# EAGLE design ClickMeter_BlackBox_v1_9_4 (EAGLE 7.6.0)

## Sheet 1 of 7: MICROCONTROLLER
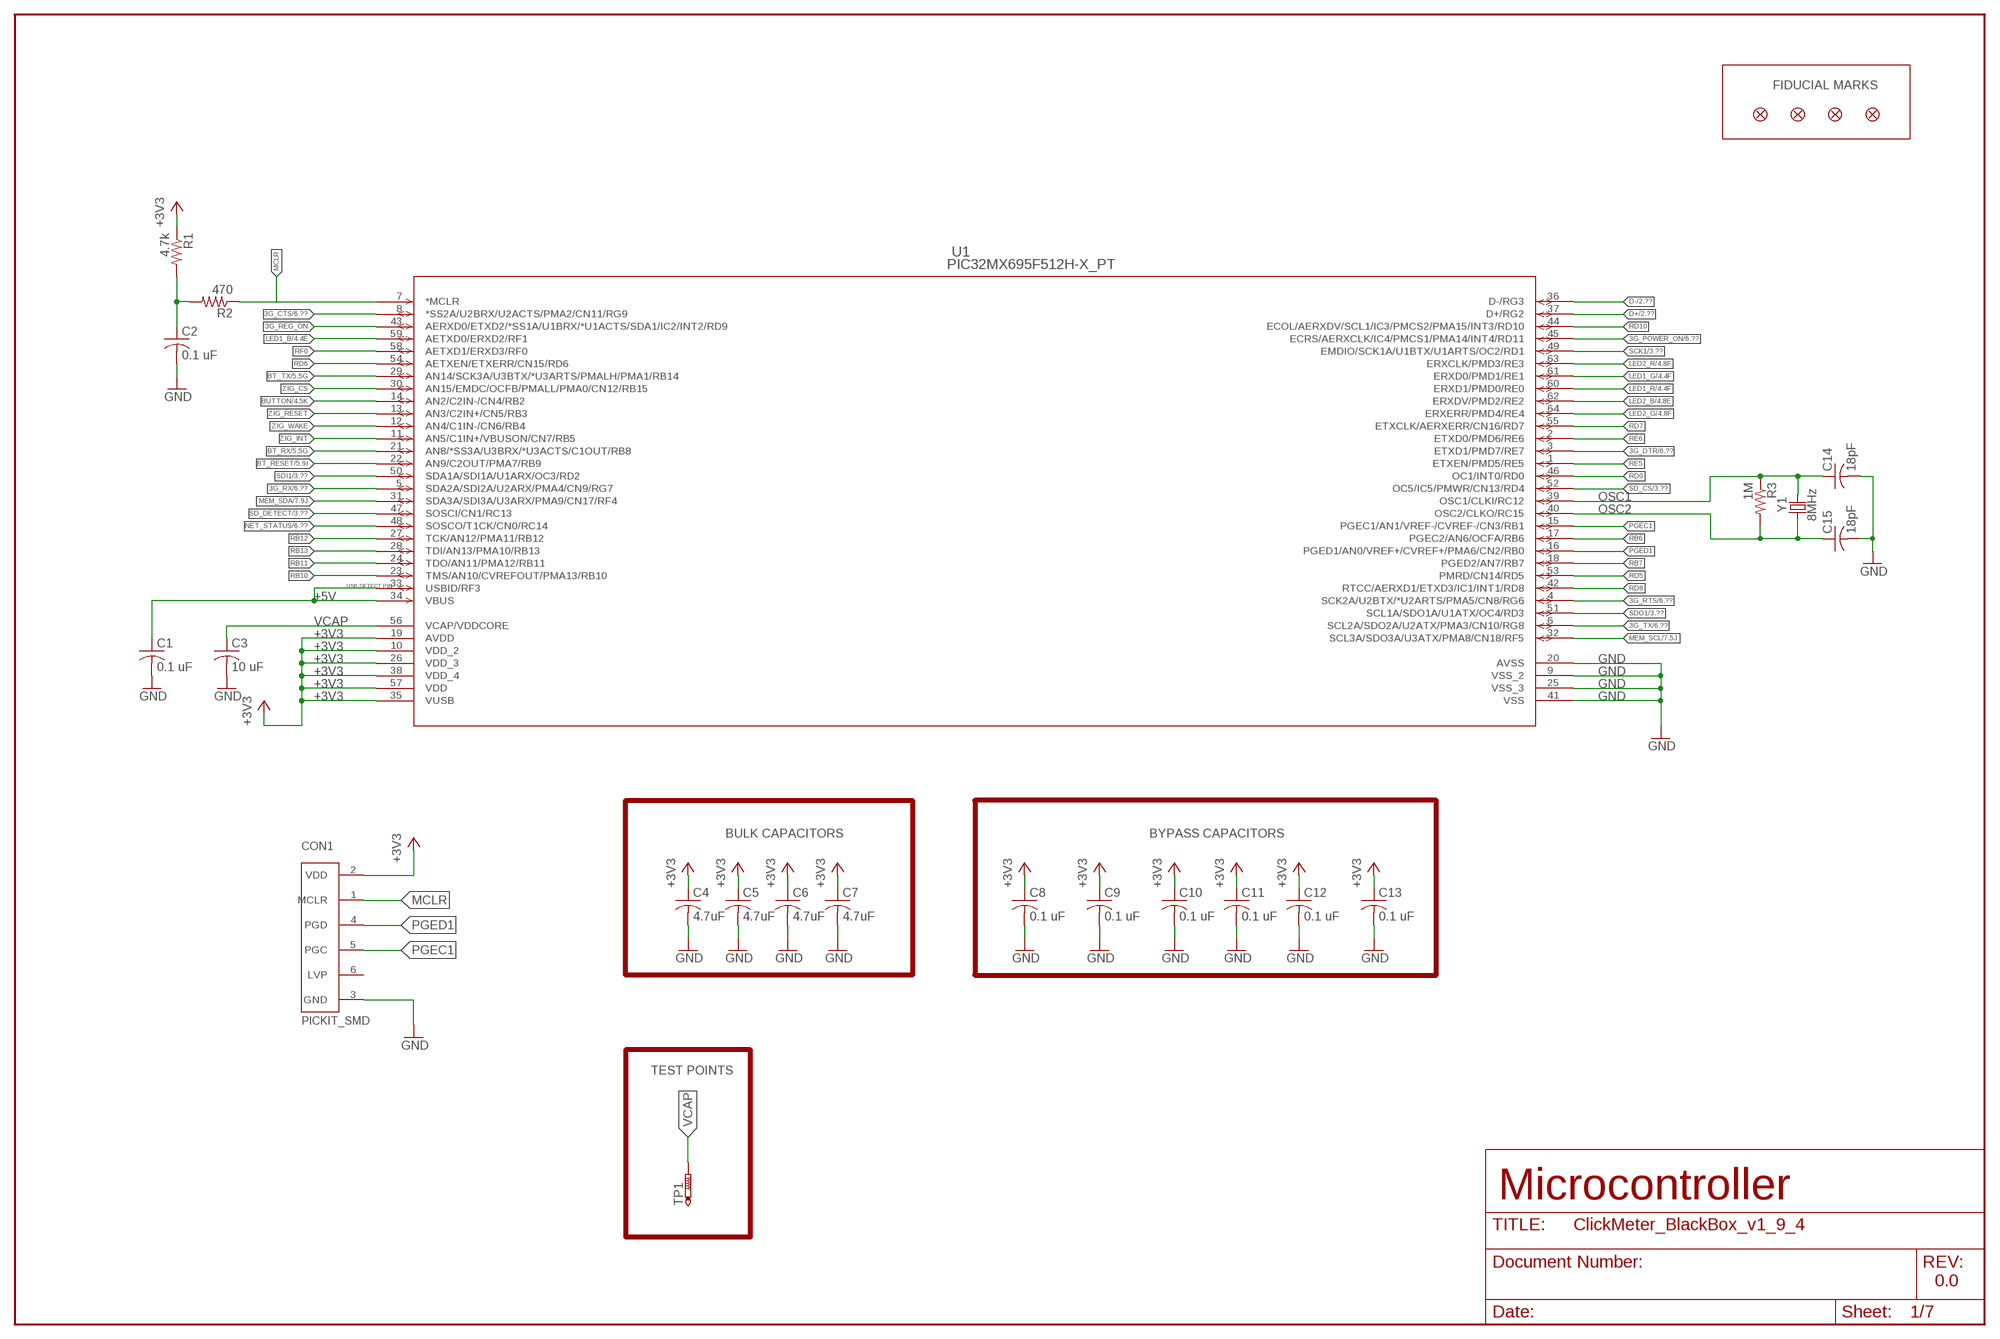
[diagram p0: schematic, sheet 1]

### Parts
C1  0.1 uF  C-USC0603  [C0603]
C2  0.1 uF  C-USC0603  [C0603]
C3  10 uF  C-USC0805  [C0805]
C4  4.7uF  C-USC0603  [C0603]
C5  4.7uF  C-USC0603  [C0603]
C6  4.7uF  C-USC0603  [C0603]
C7  4.7uF  C-USC0603  [C0603]
C8  0.1 uF  C-USC0603  [C0603]
C9  0.1 uF  C-USC0603  [C0603]
C10  0.1 uF  C-USC0603  [C0603]
C11  0.1 uF  C-USC0603  [C0603]
C12  0.1 uF  C-USC0603  [C0603]
C13  0.1 uF  C-USC0603  [C0603]
C14  18pF  C-USC0603  [C0603]
C15  18pF  C-USC0603  [C0603]
CON1  PICKIT_SMD  [SMD_PICKIT]
F1  FIDUCIAL  [FIDUCIAL]
F2  FIDUCIAL  [FIDUCIAL]
F3  FIDUCIAL  [FIDUCIAL]
F4  FIDUCIAL  [FIDUCIAL]
R1  4.7k  R-US_R0603  [R0603]
R2  470  R-US_R0603  [R0603]
R3  1M  R-US_R0603  [R0603]
TP1  PTR1B1,27  [B1,27]
U1  PIC32MX695F512H-X_PT  [TQFP64_10X10MC]
Y1  8MHz  CRYSTALTXC-7A  [CRYSTAL-TXC-7A]

### Nets
3G_CTS: U1.8(*SS2A/U2BRX/U2ACTS/PMA2/CN11/RG9) ; also sheet 6
3G_DTR: U1.3(ETXD1/PMD7/RE7) ; also sheet 6
3G_POWER_ON: U1.45(ECRS/AERXCLK/IC4/PMCS1/PMA14/INT4/RD11) ; also sheet 6
3G_REG_ON: U1.43(AERXD0/ETXD2/*SS1A/U1BRX/*U1ACTS/SDA1/IC2/INT2/RD9)
3G_RTS: U1.4(SCK2A/U2BTX/*U2ARTS/PMA5/CN8/RG6) ; also sheet 6
3G_RX: U1.5(SDA2A/SDI2A/U2ARX/PMA4/CN9/RG7) ; also sheet 6
3G_TX: U1.6(SCL2A/SDO2A/U2ATX/PMA3/CN10/RG8) ; also sheet 6
+3V3: C4.1 C5.1 C6.1 C7.1 C8.1 C9.1 C10.1 C11.1 C12.1 C13.1 CON1.2(VDD) R1.1 U1.10(VDD_2) U1.19(AVDD) U1.26(VDD_3) U1.35(VUSB) U1.38(VDD_4) U1.57(VDD) ; also sheet 2,3,4,5,7
+5V: C1.1 U1.33(USBID/RF3) U1.34(VBUS) ; also sheet 2
BT_RESET: U1.22(AN9/C2OUT/PMA7/RB9) ; also sheet 5
BT_RX: U1.21(AN8/*SS3A/U3BRX/*U3ACTS/C1OUT/RB8) ; also sheet 5
BT_TX: U1.29(AN14/SCK3A/U3BTX/*U3ARTS/PMALH/PMA1/RB14) ; also sheet 5
BUTTON: U1.14(AN2/C2IN-/CN4/RB2) ; also sheet 4
D+: U1.37(D+/RG2) ; also sheet 2
D-: U1.36(D-/RG3) ; also sheet 2
GND: C1.2 C2.2 C3.2 C4.2 C5.2 C6.2 C7.2 C8.2 C9.2 C10.2 C11.2 C12.2 C13.2 C14.2 C15.2 CON1.3(GND) U1.9(VSS_2) U1.20(AVSS) U1.25(VSS_3) U1.41(VSS) ; also sheet 2,3,4,5,6,7
LED1_B: U1.59(AETXD0/ERXD2/RF1) ; also sheet 4
LED1_G: U1.61(ERXD0/PMD1/RE1) ; also sheet 4
LED1_R: U1.60(ERXD1/PMD0/RE0) ; also sheet 4
LED2_B: U1.62(ERXDV/PMD2/RE2) ; also sheet 4
LED2_G: U1.64(ERXERR/PMD4/RE4) ; also sheet 4
LED2_R: U1.63(ERXCLK/PMD3/RE3) ; also sheet 4
MCLR: CON1.1(MCLR) R2.1 U1.7(*MCLR)
MEM_SCL: U1.32(SCL3A/SDO3A/U3ATX/PMA8/CN18/RF5) ; also sheet 7
MEM_SDA: U1.31(SDA3A/SDI3A/U3ARX/PMA9/CN17/RF4) ; also sheet 7
N$3: C2.1 R1.2 R2.2
NET_STATUS: U1.48(SOSCO/T1CK/CN0/RC14) ; also sheet 6
OSC1: C14.1 R3.1 U1.39(OSC1/CLKI/RC12) Y1.P$2
OSC2: C15.1 R3.2 U1.40(OSC2/CLKO/RC15) Y1.P$1
PGEC1: CON1.5(PGC) U1.15(PGEC1/AN1/VREF-/CVREF-/CN3/RB1)
PGED1: CON1.4(PGD) U1.16(PGED1/AN0/VREF+/CVREF+/PMA6/CN2/RB0)
RB6: U1.17(PGEC2/AN6/OCFA/RB6)
RB7: U1.18(PGED2/AN7/RB7)
RB10: U1.23(TMS/AN10/CVREFOUT/PMA13/RB10)
RB11: U1.24(TDO/AN11/PMA12/RB11)
RB12: U1.27(TCK/AN12/PMA11/RB12)
RB13: U1.28(TDI/AN13/PMA10/RB13)
RD0: U1.46(OC1/INT0/RD0)
RD5: U1.53(PMRD/CN14/RD5)
RD6: U1.54(AETXEN/ETXERR/CN15/RD6)
RD7: U1.55(ETXCLK/AERXERR/CN16/RD7)
RD8: U1.42(RTCC/AERXD1/ETXD3/IC1/INT1/RD8)
RD10: U1.44(ECOL/AERXDV/SCL1/IC3/PMCS2/PMA15/INT3/RD10)
RE5: U1.1(ETXEN/PMD5/RE5)
RE6: U1.2(ETXD0/PMD6/RE6)
RF0: U1.58(AETXD1/ERXD3/RF0)
SCK1: U1.49(EMDIO/SCK1A/U1BTX/U1ARTS/OC2/RD1) ; also sheet 3
SD_CS: U1.52(OC5/IC5/PMWR/CN13/RD4) ; also sheet 3
SD_DETECT: U1.47(SOSCI/CN1/RC13) ; also sheet 3
SDI1: U1.50(SDA1A/SDI1A/U1ARX/OC3/RD2) ; also sheet 3
SDO1: U1.51(SCL1A/SDO1A/U1ATX/OC4/RD3) ; also sheet 3
VCAP: C3.1 TP1.TP U1.56(VCAP/VDDCORE)
ZIG_CS: U1.30(AN15/EMDC/OCFB/PMALL/PMA0/CN12/RB15)
ZIG_INT: U1.11(AN5/C1IN+/VBUSON/CN7/RB5)
ZIG_RESET: U1.13(AN3/C2IN+/CN5/RB3)
ZIG_WAKE: U1.12(AN4/C1IN-/CN6/RB4)
Unconnected: CON1.6(LVP)

### Notes on the sheet
- FIDUCIAL MARKS
- USB DETECT PIN
- BULK CAPACITORS | BYPASS CAPACITORS
- TEST POINTS
- Microcontroller
- 0.0

## Sheet 2 of 7: POWER SUPPLY
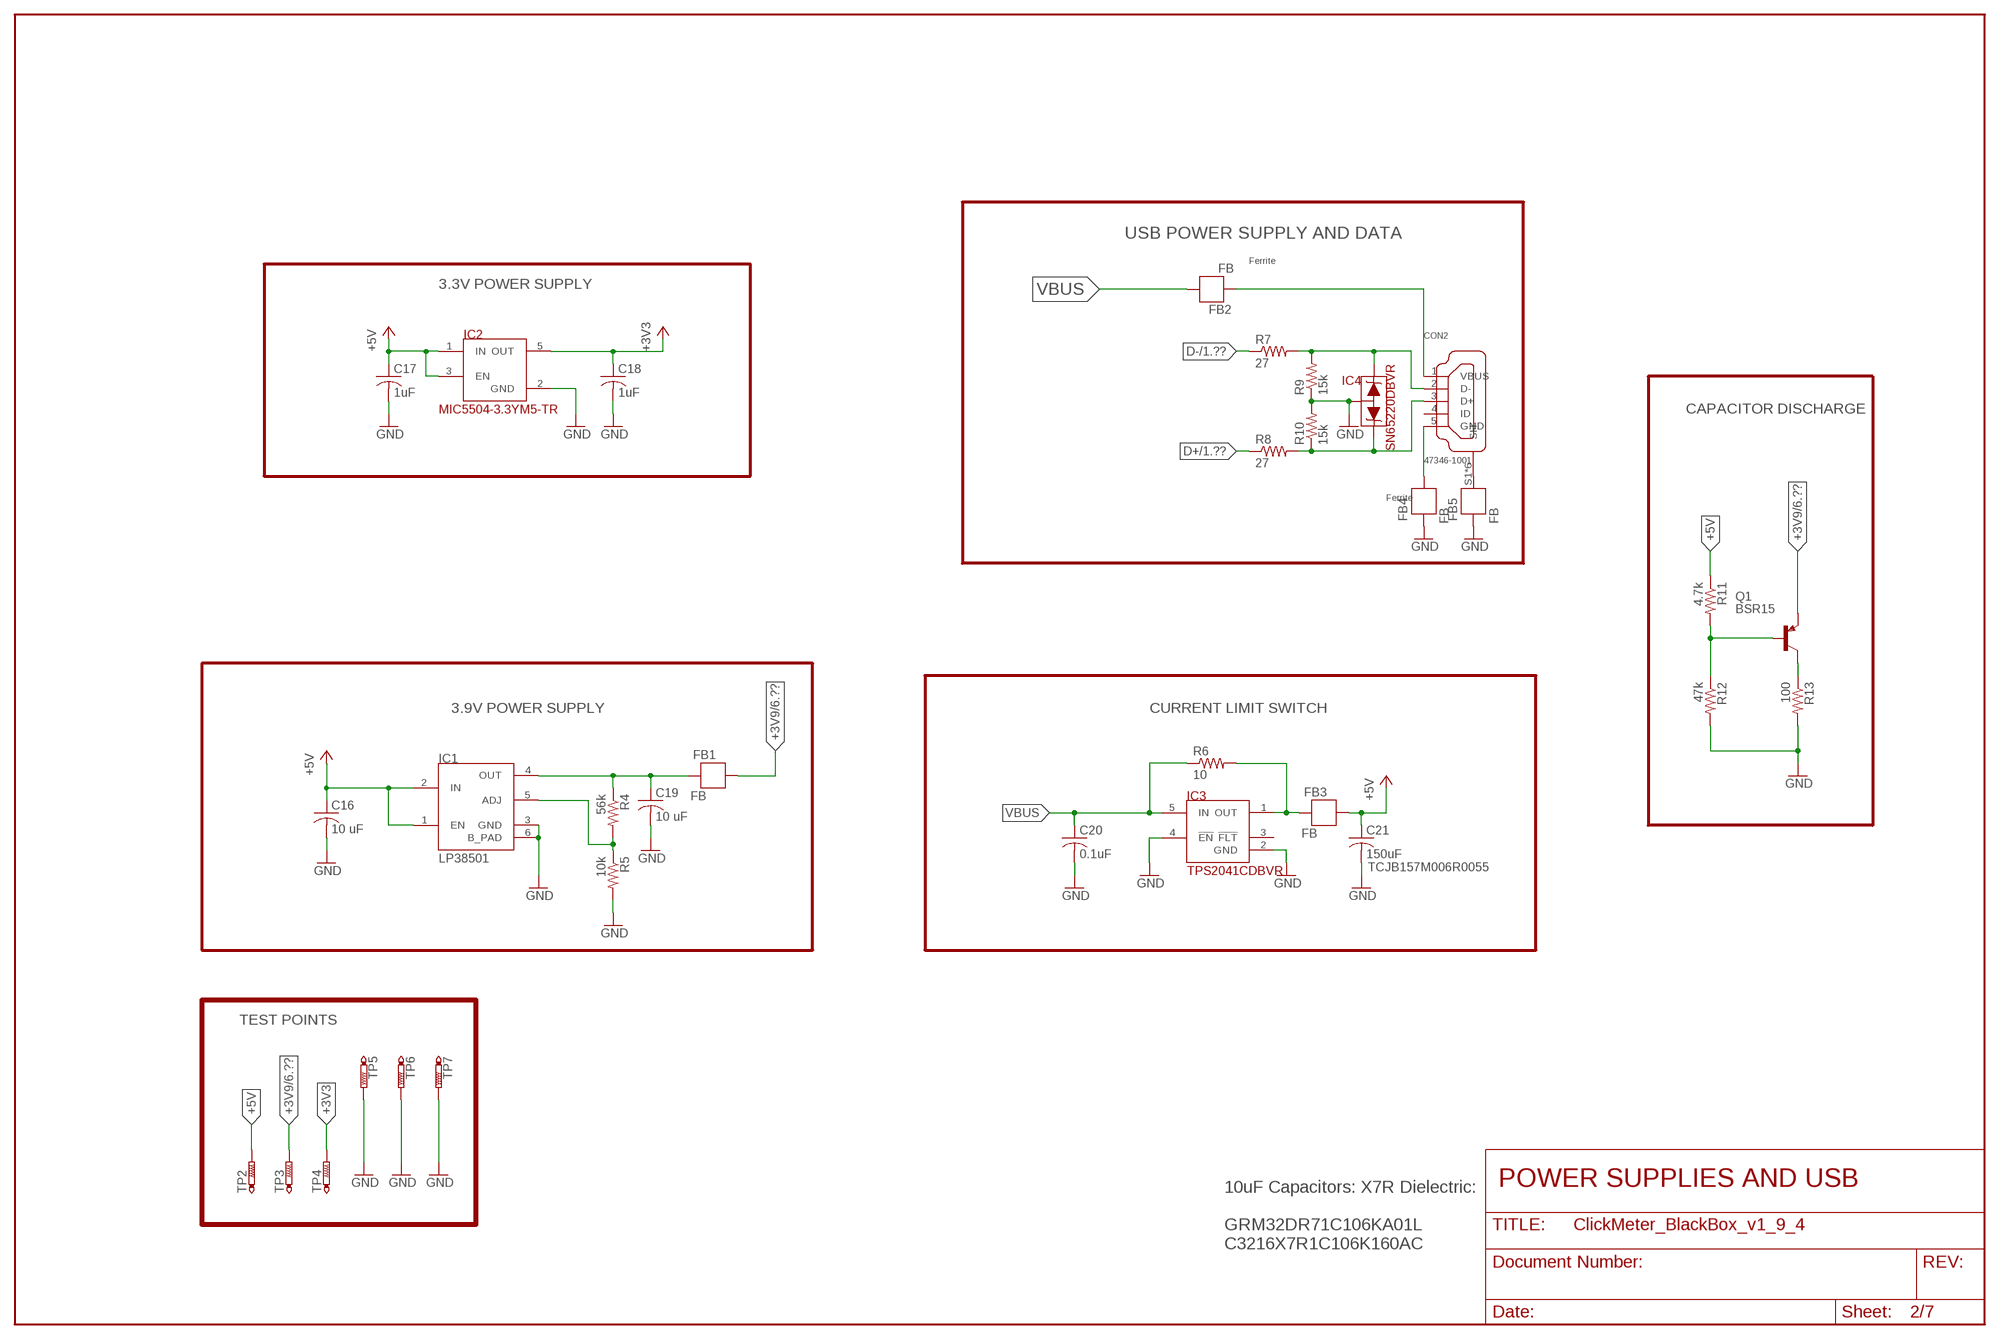
[diagram p1: schematic, sheet 2]

### Parts
C16  10 uF  C-USC0805  [C0805]
C17  1uF  C-USC0603  [C0603]
C18  1uF  C-USC0603  [C0603]
C19  10 uF  C-USC0805  [C0805]
C20  0.1uF  C-USC0603  [C0603]
C21  150uF  C-USC1210  [C1210]
CON2  47346-1001  [47346-1001]
FB1  FB  [0603]
FB2  FB  [0603]
FB3  FB  [0603]
FB4  FB  [0603]
FB5  FB  [0603]
IC1  LP38501  [TO-263-5]
IC2  MIC5504-3.3YM5-TR  [SOT-23-5]
IC3  TPS2041CDBVR  [SOT-23-5]
IC4  SN65220DBVR  [SOT-23-6]
Q1  BSR15  [SOT23]
R4  56k  R-US_R0603  [R0603]
R5  10k  R-US_R0603  [R0603]
R6  10  R-US_R2010  [R2010]
R7  27  R-US_R0603  [R0603]
R8  27  R-US_R0603  [R0603]
R9  15k  R-US_R0603  [R0603]
R10  15k  R-US_R0603  [R0603]
R11  4.7k  R-US_R0603  [R0603]
R12  47k  R-US_R0603  [R0603]
R13  100  R-US_R0603  [R0603]
TP2  PTR1B1,27  [B1,27]
TP3  PTR1B1,27  [B1,27]
TP4  PTR1B1,27  [B1,27]
TP5  PTR1B1,27  [B1,27]
TP6  PTR1B1,27  [B1,27]
TP7  PTR1B1,27  [B1,27]

### Nets
+3V3: C18.1 IC2.5(OUT) TP4.TP ; also sheet 1,3,4,5,7
+3V9: FB1.1 Q1.2(E) TP3.TP ; also sheet 6
+5V: C16.1 C17.1 C21.1 FB3.1 IC1.1(EN) IC1.2(IN) IC2.1(IN) IC2.3(EN) R11.1 TP2.TP ; also sheet 1
D+: R8.1 ; also sheet 1
D-: R7.1 ; also sheet 1
GND: C16.2 C17.2 C18.2 C19.2 C20.2 C21.2 FB4.2 FB5.2 IC1.3(GND) IC1.6(B_PAD) IC2.2(GND) IC3.2(GND) IC3.4(!EN!) IC4.2(GND) IC4.5(GND) R5.2 R9.1 R10.2 R12.2 R13.2 TP5.TP TP6.TP TP7.TP ; also sheet 1,3,4,5,6,7
N$1: C19.1 FB1.2 IC1.4(OUT) R4.1
N$5: IC1.5(ADJ) R4.2 R5.1
N$6: CON2.1(VBUS) FB2.2
N$7: FB3.2 IC3.1(OUT) R6.2
N$18: Q1.1(B) R11.2 R12.1
N$19: Q1.3(C) R13.1
N$30: CON2.S1(SH) CON2.S2(SH) CON2.S3(SH) CON2.S4(SH) CON2.S5(SH) CON2.S6(SH) FB5.1
N$31: CON2.5(GND) FB4.1
N$32: CON2.2(D-) IC4.4(B) R7.2 R9.2
N$33: CON2.3(D+) IC4.6(A) R8.2 R10.1
VBUS: C20.1 FB2.1 IC3.5(IN) R6.1
Unconnected: CON2.4(ID) IC3.3(!FLT!)

### Notes on the sheet
- USB POWER SUPPLY AND DATA
- Ferrite
- 3.3V POWER SUPPLY
- CAPACITOR DISCHARGE
- Ferrite
- 3.9V POWER SUPPLY | CURRENT LIMIT SWITCH
- TCJB157M006R0055
- TEST POINTS
- POWER SUPPLIES AND USB
- 10uF Capacitors: X7R Dielectric:
  
  GRM32DR71C106KA01L
  C3216X7R1C106K160AC

## Sheet 3 of 7: MICRO SIM/MICRO SD
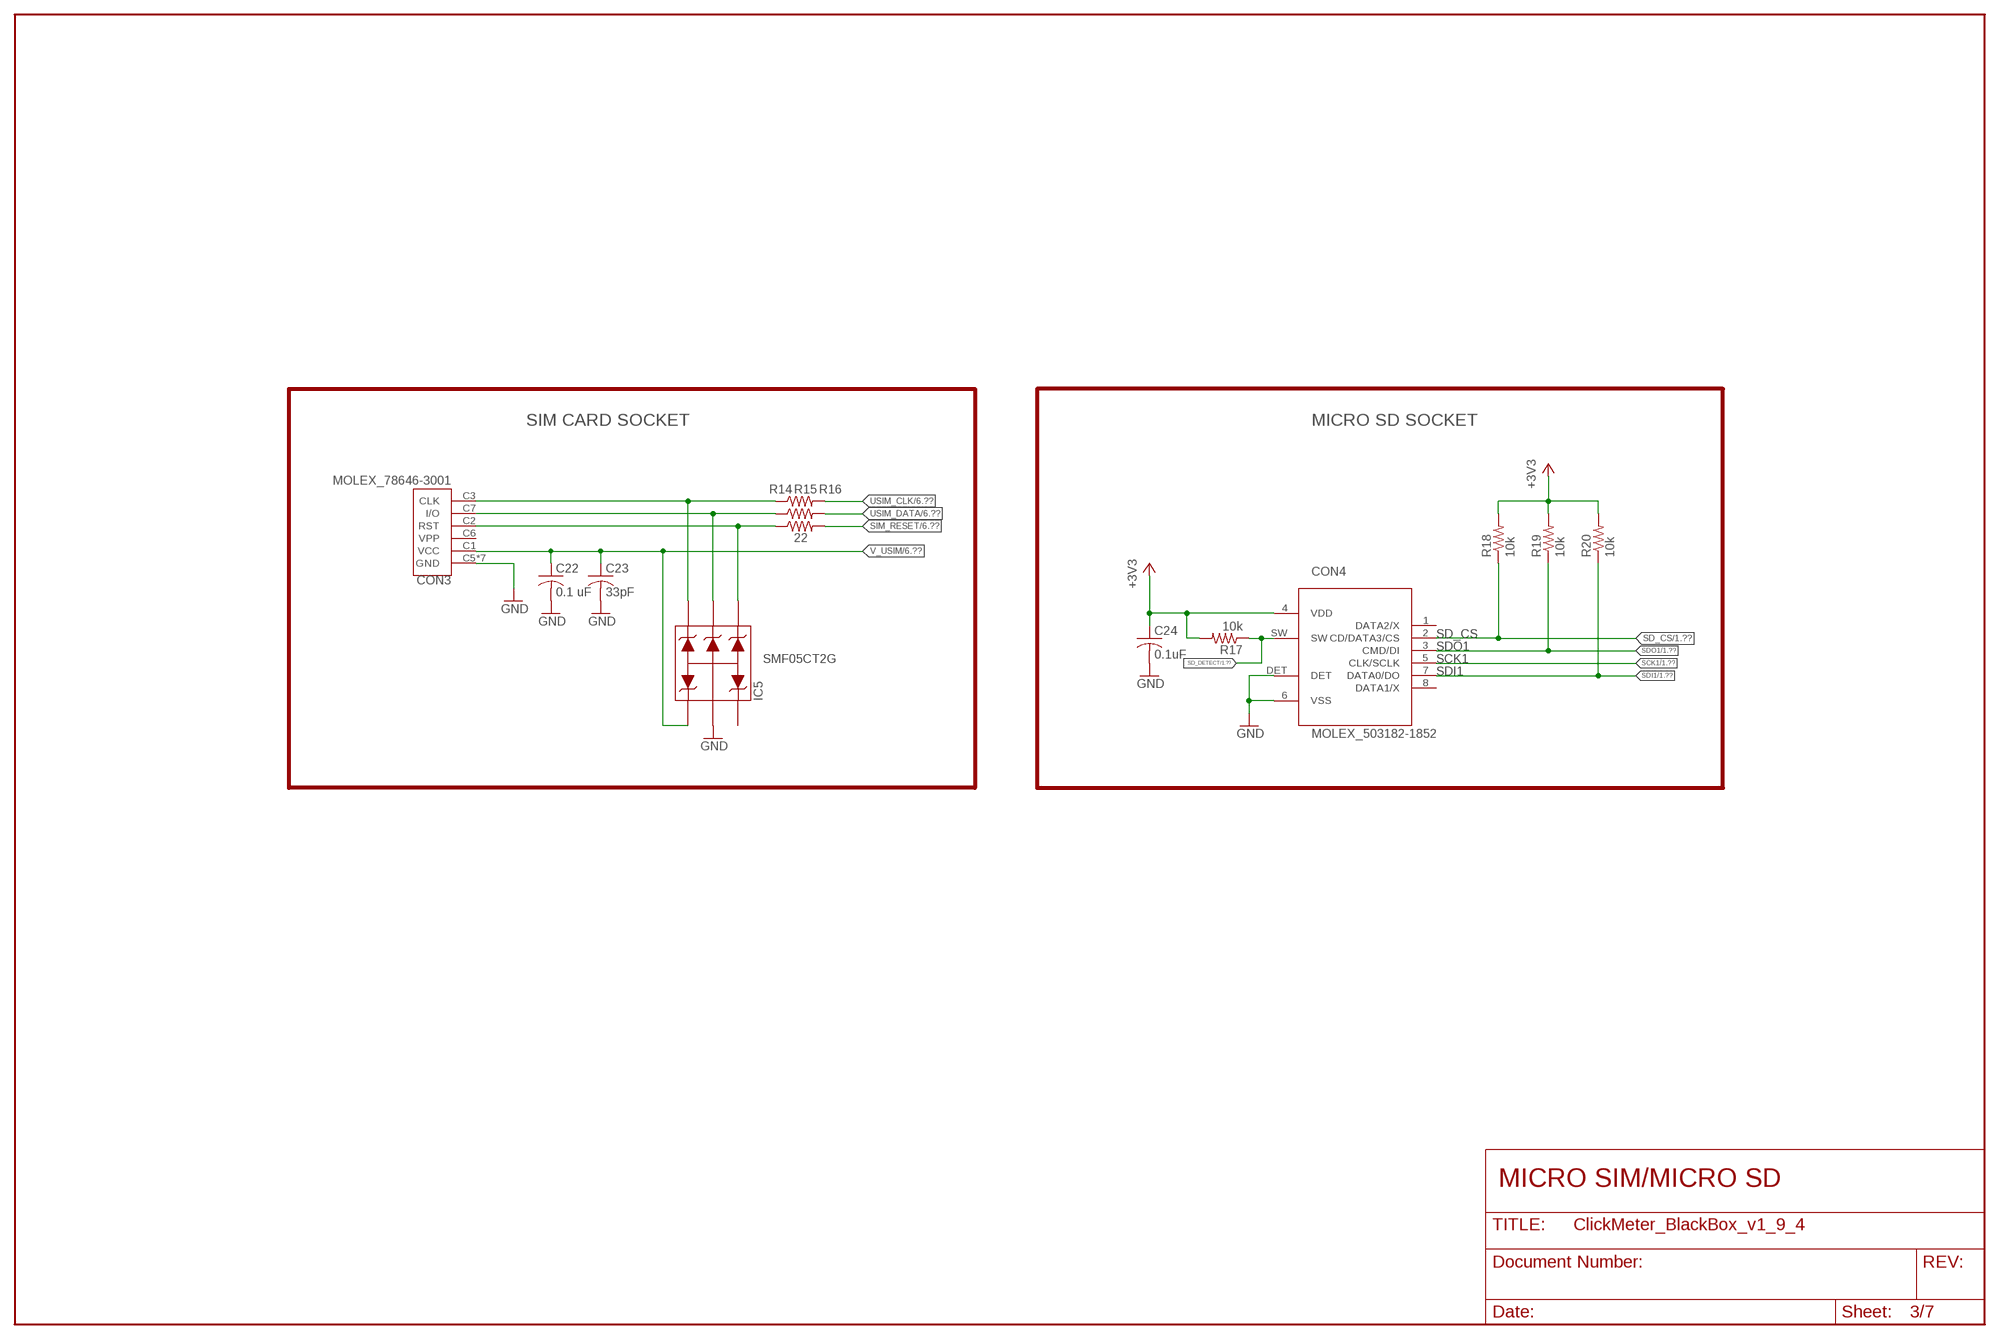
[diagram p2: schematic, sheet 3]

### Parts
C22  0.1 uF  C-USC0603  [C0603]
C23  33pF  C-USC0603  [C0603]
C24  0.1uF  C-USC0603  [C0603]
CON3  MOLEX_78646-3001  [MOLEX_78646-3001]
CON4  MOLEX_503182-1852  [MOLEX_503182-1852]
IC5  SMF05CT2G  [SC-88/SC70-6/SOT-363]
R14  22  R-US_R0603  [R0603]
R15  22  R-US_R0603  [R0603]
R16  22  R-US_R0603  [R0603]
R17  10k  R-US_R0603  [R0603]
R18  10k  R-US_R0603  [R0603]
R19  10k  R-US_R0603  [R0603]
R20  10k  R-US_R0603  [R0603]

### Nets
+3V3: C24.1 CON4.4(VDD) R17.2 R18.2 R19.2 R20.2 ; also sheet 1,2,4,5,7
GND: C22.2 C23.2 C24.2 CON3.C5(GND) CON3.GND1(GND) CON3.GND2(GND) CON3.GND3(GND) CON3.GND4(GND) CON3.GND5(GND) CON3.GND6(GND) CON4.6(VSS) CON4.DET IC5.2(AN) ; also sheet 1,2,4,5,6,7
N$9: CON3.C3(CLK) IC5.6(C5) R14.1
N$24: CON3.C7(I/O) IC5.5(C4) R15.1
N$25: CON3.C2(RST) IC5.4(C3) R16.1
SCK1: CON4.5(CLK/SCLK) ; also sheet 1
SD_CS: CON4.2(CD/DATA3/CS) R18.1 ; also sheet 1
SD_DETECT: CON4.SW R17.1 ; also sheet 1
SDI1: CON4.7(DATA0/DO) R20.1 ; also sheet 1
SDO1: CON4.3(CMD/DI) R19.1 ; also sheet 1
SIM_RESET: R16.2 ; also sheet 6
USIM_CLK: R14.2 ; also sheet 6
USIM_DATA: R15.2 ; also sheet 6
V_USIM: C22.1 C23.1 CON3.C1(VCC) IC5.1(C1) ; also sheet 6
Unconnected: CON3.C6(VPP) CON4.1(DATA2/X) CON4.8(DATA1/X) IC5.3(C2)

### Notes on the sheet
- SIM CARD SOCKET | MICRO SD SOCKET
- MICRO SIM/MICRO SD

## Sheet 4 of 7: FEEDBACK
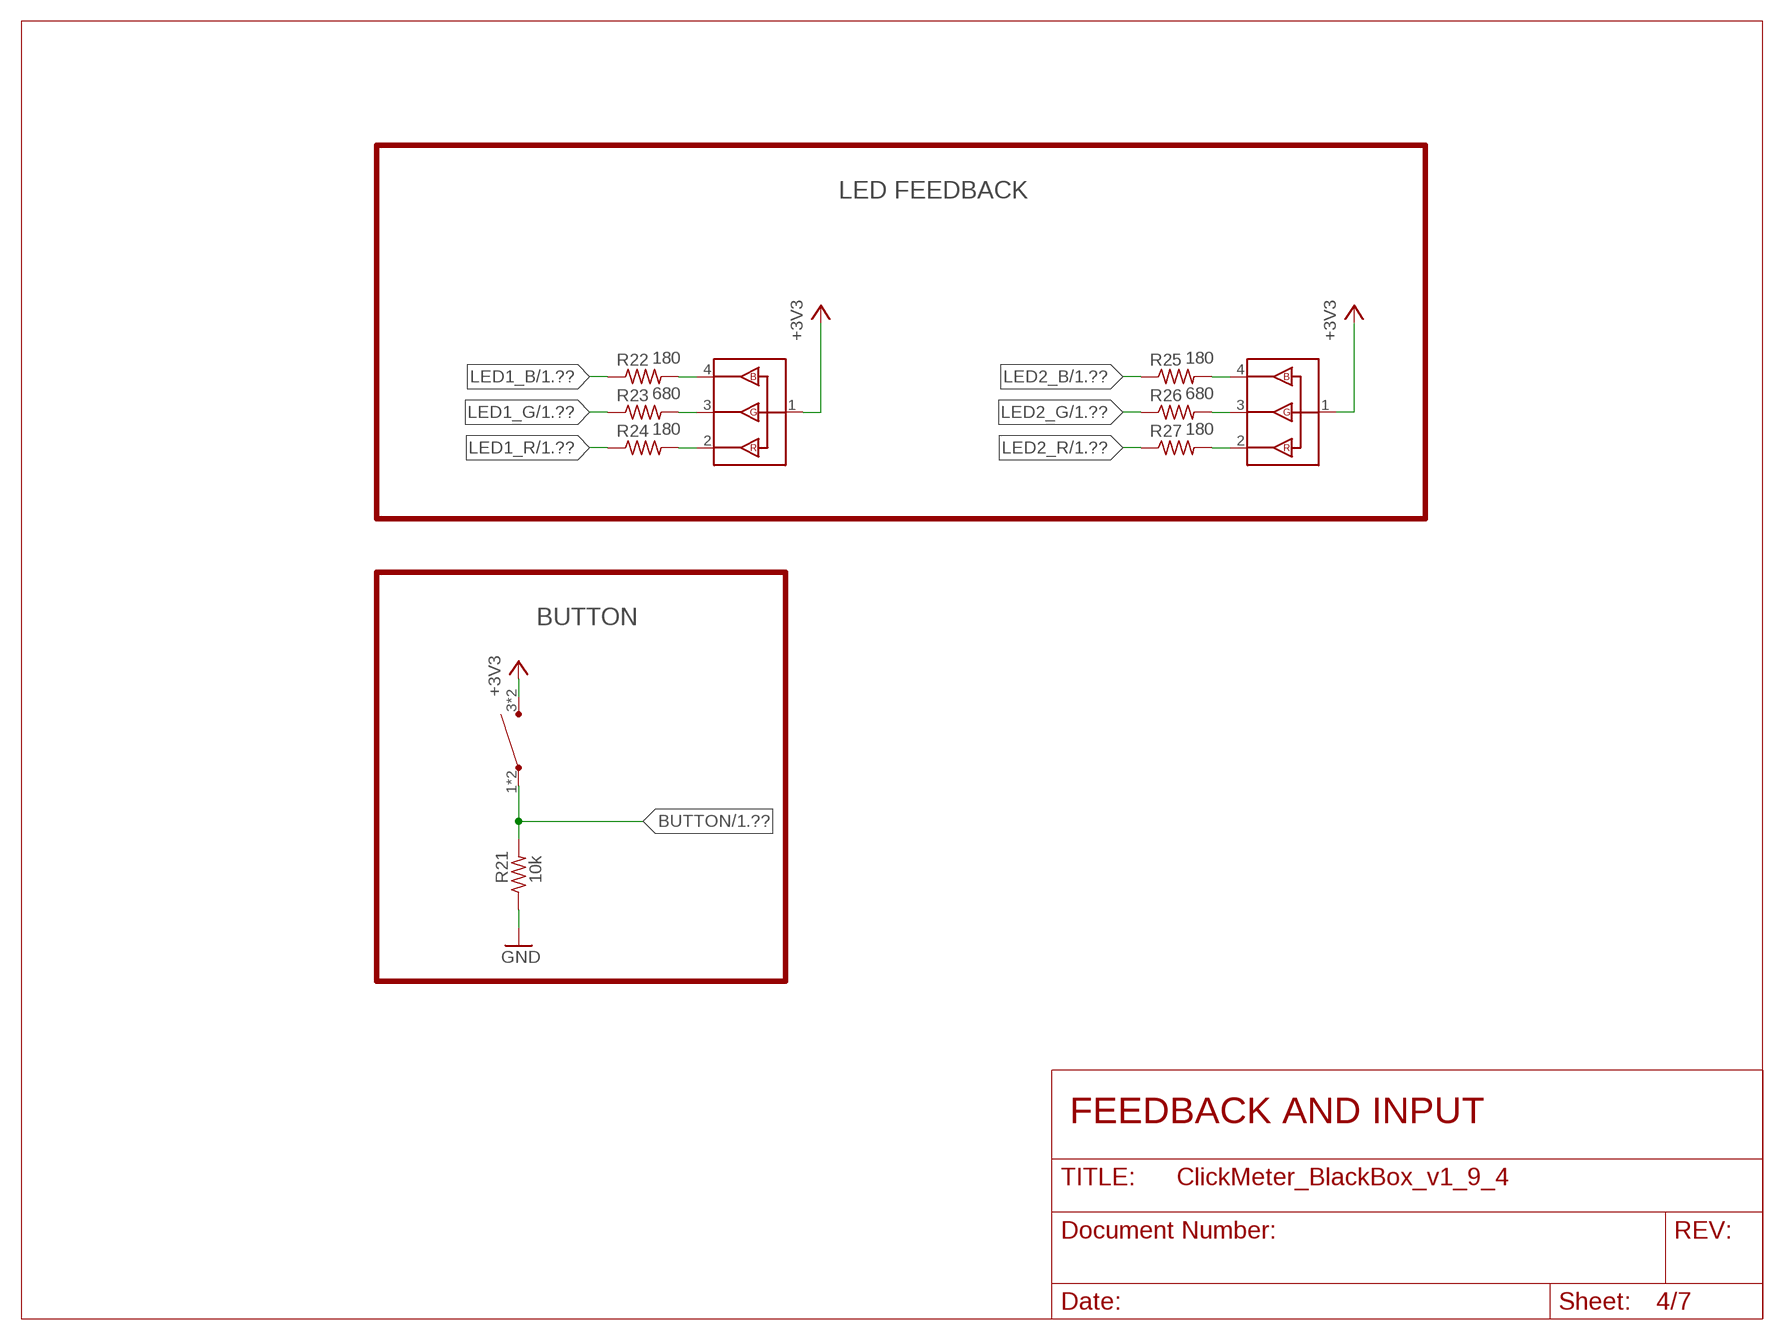
[diagram p3: schematic, sheet 4]

### Parts
BT1  PTS525_SM15  [PTS525SM15SMTR2]
LED1  APTF1616SEEZGQBDC  [APTF1616SEEZGQBDC]
LED2  APTF1616SEEZGQBDC  [APTF1616SEEZGQBDC]
R21  10k  R-US_R0603  [R0603]
R22  180  R-US_R0603  [R0603]
R23  680  R-US_R0603  [R0603]
R24  180  R-US_R0603  [R0603]
R25  180  R-US_R0603  [R0603]
R26  680  R-US_R0603  [R0603]
R27  180  R-US_R0603  [R0603]

### Nets
+3V3: BT1.3 BT1.4 LED1.1 LED2.1 ; also sheet 1,2,3,5,7
BUTTON: BT1.1 BT1.2 R21.2 ; also sheet 1
GND: R21.1 ; also sheet 1,2,3,5,6,7
LED1_B: R22.1 ; also sheet 1
LED1_G: R23.1 ; also sheet 1
LED1_R: R24.1 ; also sheet 1
LED2_B: R25.1 ; also sheet 1
LED2_G: R26.1 ; also sheet 1
LED2_R: R27.1 ; also sheet 1
N$8: LED1.3 R23.2
N$10: LED1.2 R24.2
N$11: LED1.4 R22.2
N$12: LED2.3 R26.2
N$13: LED2.2 R27.2
N$14: LED2.4 R25.2

### Notes on the sheet
- LED FEEDBACK
- BUTTON
- FEEDBACK AND INPUT

## Sheet 5 of 7: BLUETOOTH
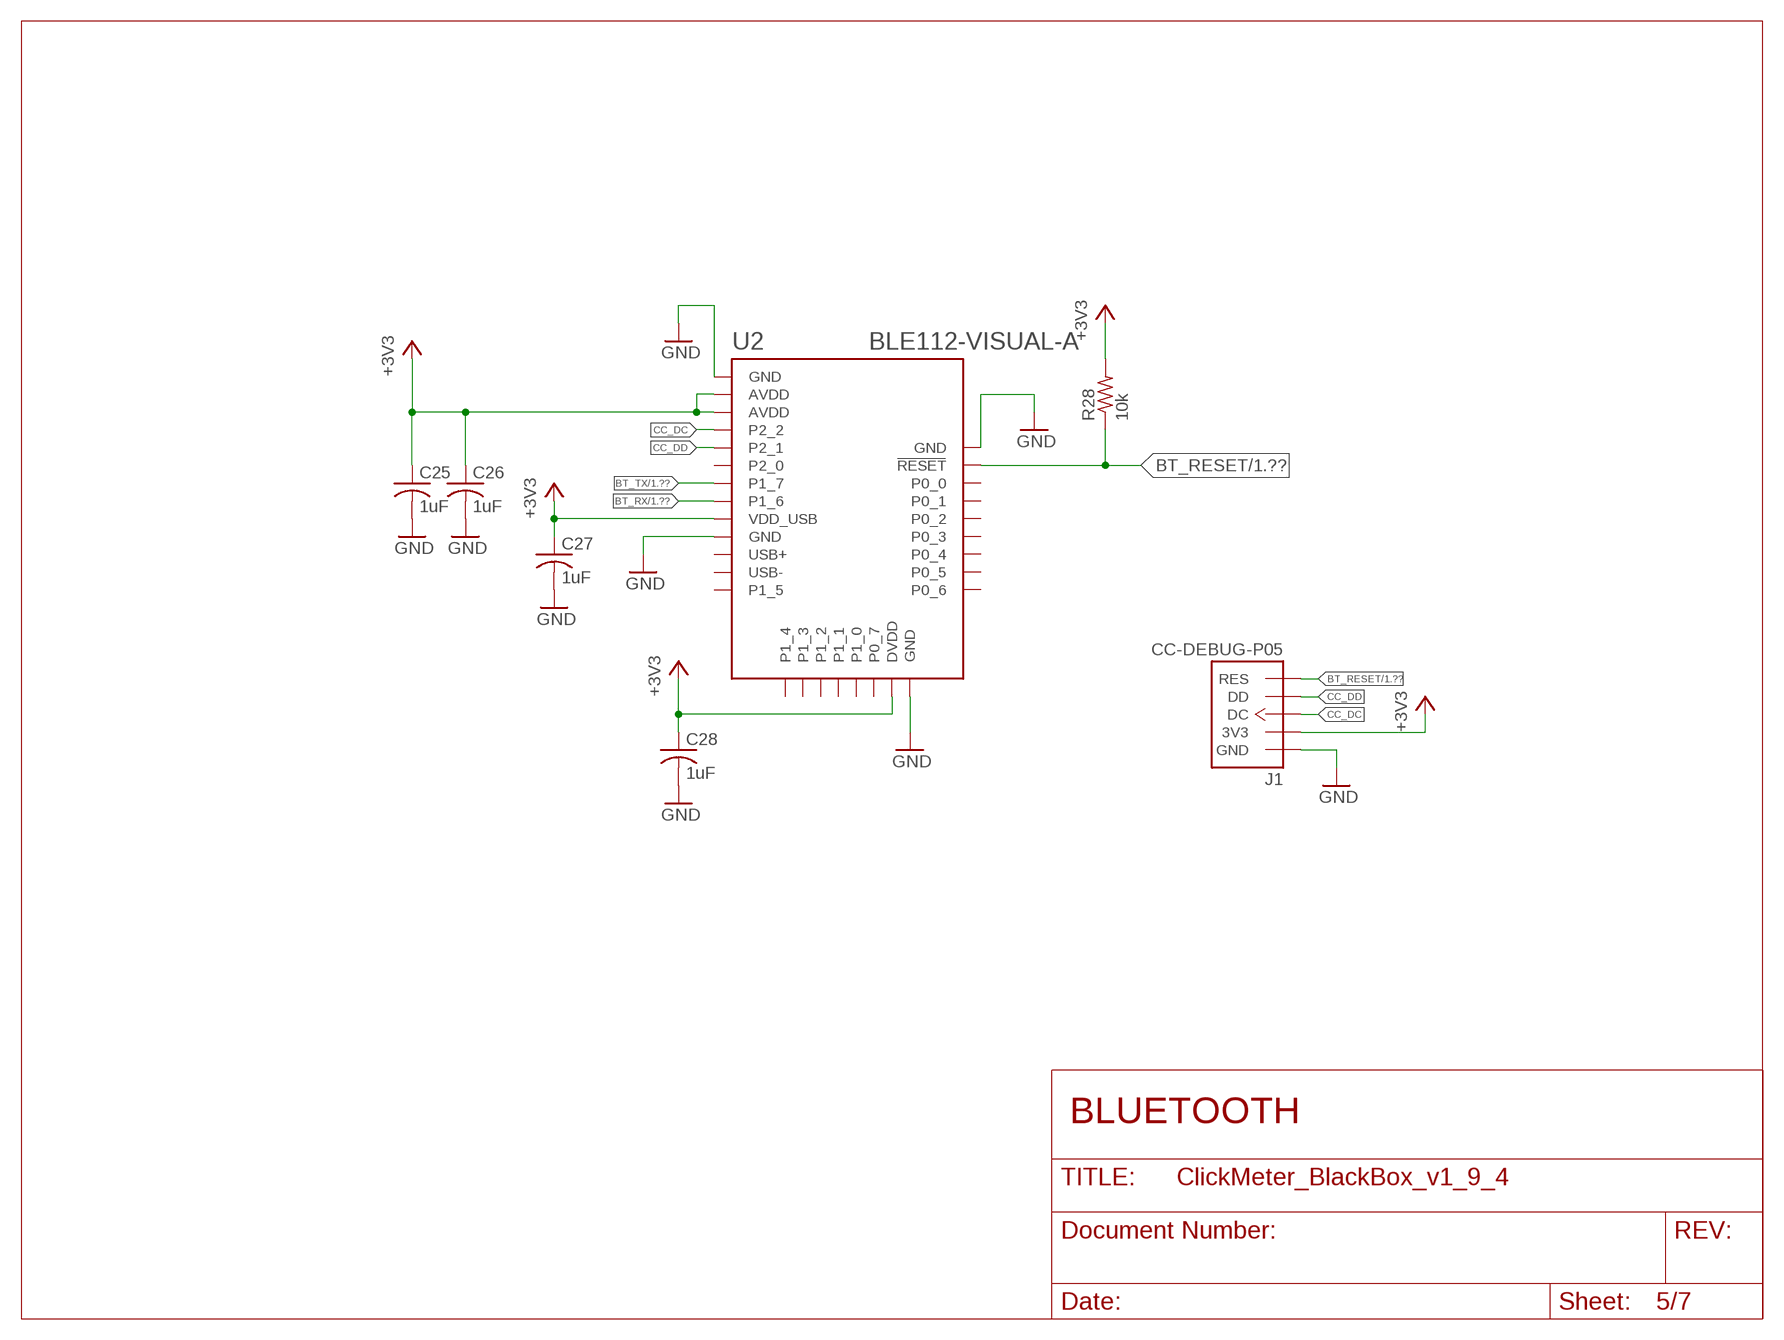
[diagram p4: schematic, sheet 5]

### Parts
C25  1uF  C-USC0603  [C0603]
C26  1uF  C-USC0603  [C0603]
C27  1uF  C-USC0603  [C0603]
C28  1uF  C-USC0603  [C0603]
J1  CC-DEBUG-P05  [CC-P05]
R28  10k  R-US_R0603  [R0603]
U2  BLE112-VISUAL-A  [BLE112-A]

### Nets
+3V3: C25.1 C26.1 C27.1 C28.1 J1.2(3V3) R28.2 U2.AVDD U2.AVDD@2(AVDD) U2.DVDD U2.VDD_USB ; also sheet 1,2,3,4,7
BT_RESET: J1.7(RES) R28.1 U2.RESET ; also sheet 1
BT_RX: U2.P1_6 ; also sheet 1
BT_TX: U2.P1_7 ; also sheet 1
CC_DC: J1.3(DC) U2.P2_2
CC_DD: J1.4(DD) U2.P2_1
GND: C25.2 C26.2 C27.2 C28.2 J1.1(GND) U2.GND U2.GND@2(GND) U2.GND@3(GND) U2.GND@4(GND) ; also sheet 1,2,3,4,6,7
Unconnected: U2.P0_0 U2.P0_1 U2.P0_2 U2.P0_3 U2.P0_4 U2.P0_5 U2.P0_6 U2.P0_7 U2.P1_0 U2.P1_1 U2.P1_2 U2.P1_3 U2.P1_4 U2.P1_5 U2.P2_0 U2.USB+ U2.USB-

### Notes on the sheet
- BLUETOOTH

## Sheet 6 of 7: 3G MODULE
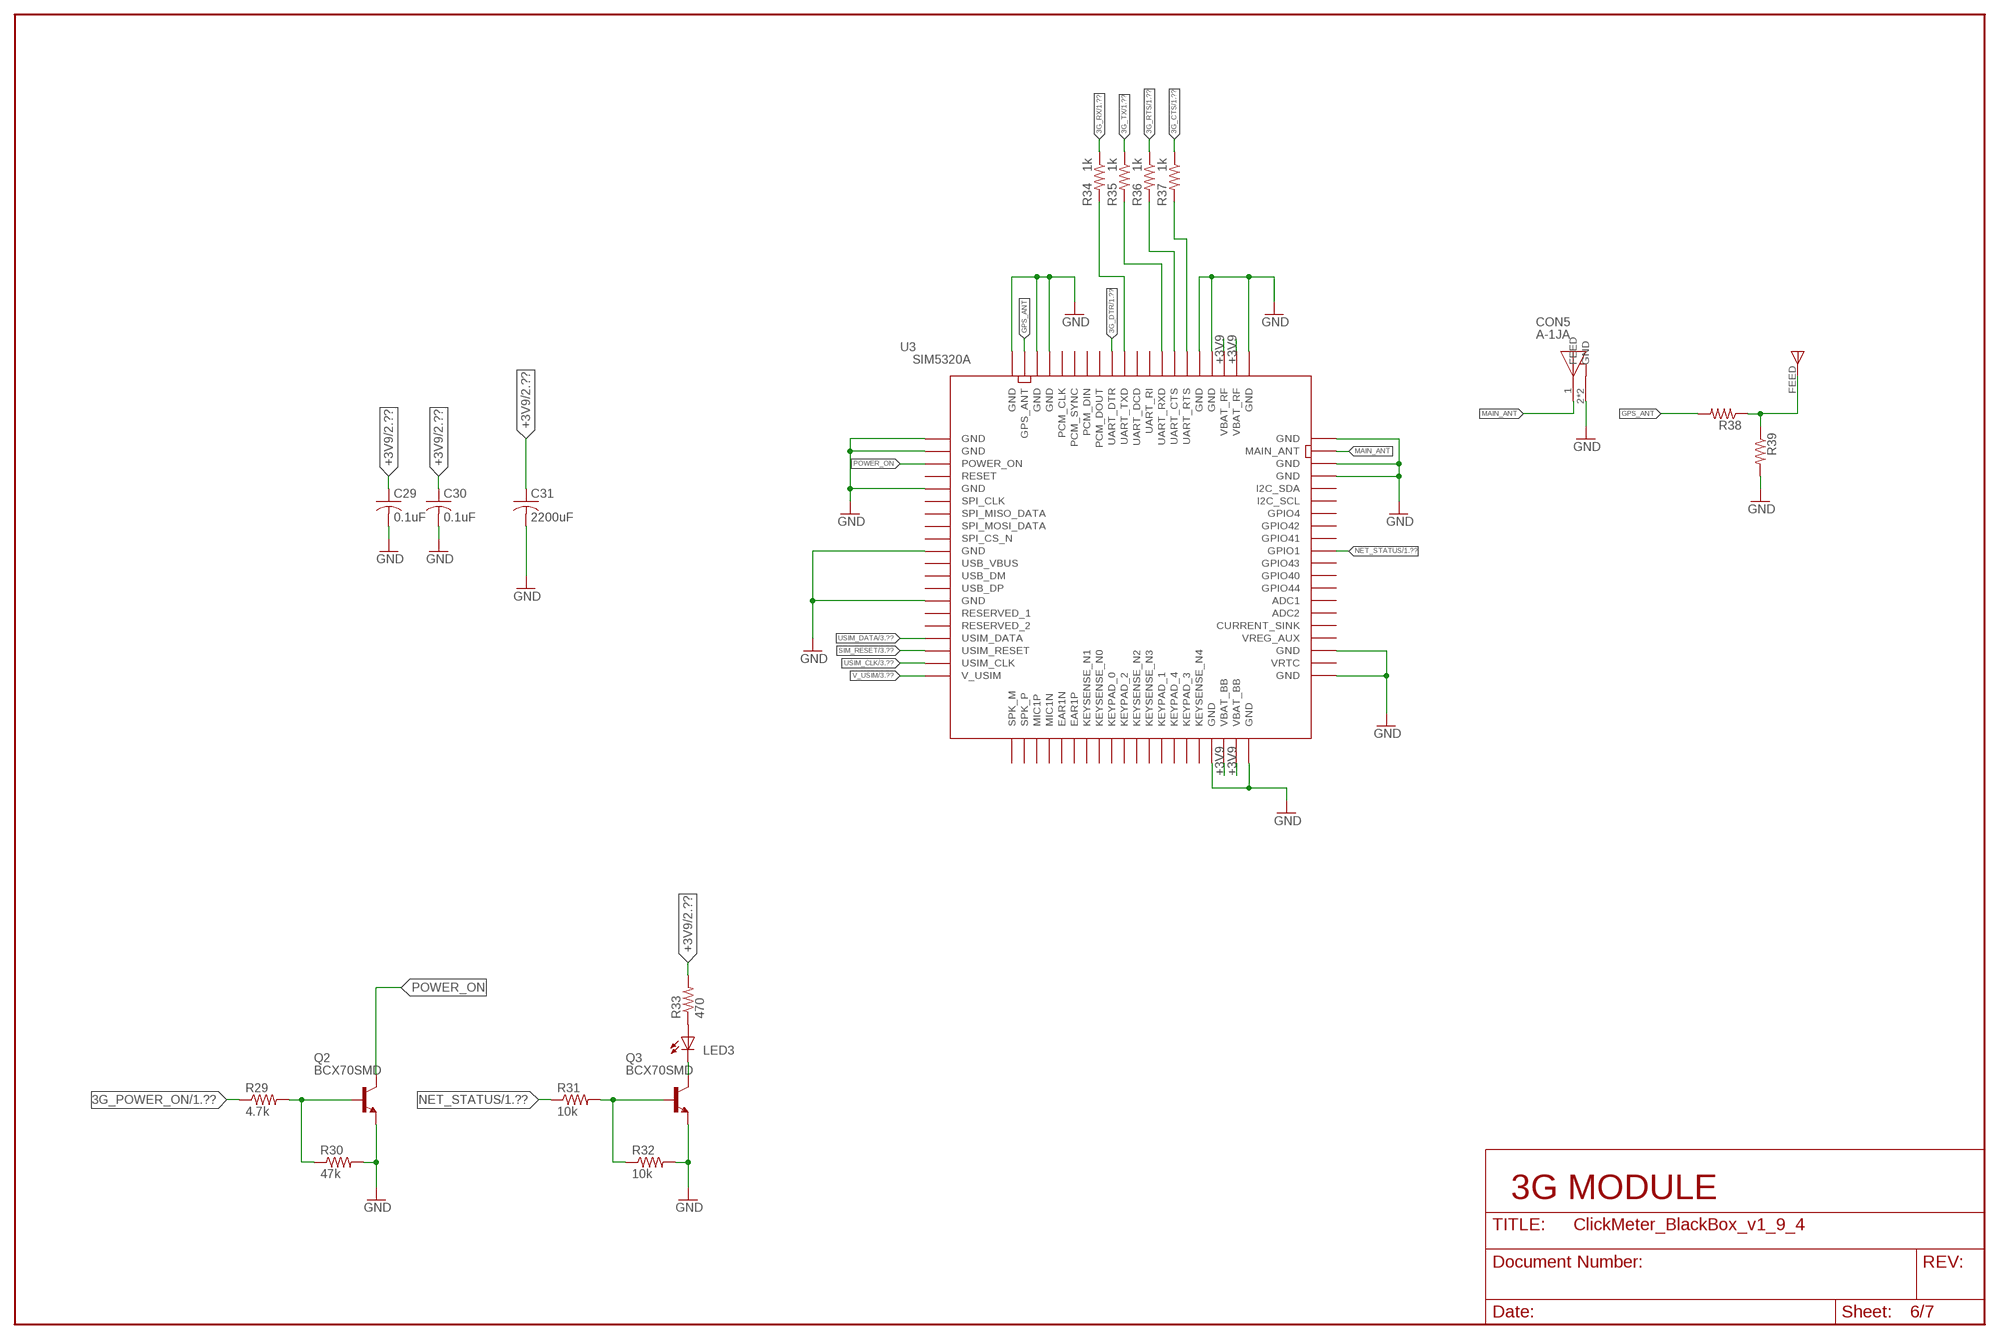
[diagram p5: schematic, sheet 6]

### Parts
ANT1  1575AT43A0040E  [1575AT43A0040E]
C29  0.1uF  C-USC0603  [C0603]
C30  0.1uF  C-USC0603  [C0603]
C31  2200uF  C-USTANTALUM-592D  [592D-2200]
CON5  A-1JA  [A-1JA]
LED3  LED_ESML0603  [LED_SML0603]
Q2  BCX70SMD  [SOT23]
Q3  BCX70SMD  [SOT23]
R29  4.7k  R-US_R0603  [R0603]
R30  47k  R-US_R0603  [R0603]
R31  10k  R-US_R0603  [R0603]
R32  10k  R-US_R0603  [R0603]
R33  470  R-US_R0603  [R0603]
R34  1k  R-US_R0402  [R0402]
R35  1k  R-US_R0402  [R0402]
R36  1k  R-US_R0402  [R0402]
R37  1k  R-US_R0402  [R0402]
R38  R-US_R0402  [R0402]
R39  R-US_R0402  [R0402]
U3  SIM5320A  [SIM5320A]

### Nets
3G_CTS: R37.1 ; also sheet 1
3G_DTR: U3.P$72(UART_DTR) ; also sheet 1
3G_POWER_ON: R29.1 ; also sheet 1
3G_RTS: R36.1 ; also sheet 1
3G_RX: R34.1 ; also sheet 1
3G_TX: R35.1 ; also sheet 1
+3V9: C29.1 C30.1 C31.1 R33.2 U3.P$38(VBAT_BB) U3.P$39(VBAT_BB) U3.P$62(VBAT_RF) U3.P$63(VBAT_RF) ; also sheet 2
GND: C29.2 C30.2 C31.2 CON5.2(GND) CON5.3(GND) Q2.2(E) Q3.2(E) R30.2 R32.2 R39.2 U3.P$1(GND) U3.P$2(GND) U3.P$5(GND) U3.P$10(GND) U3.P$14(GND) U3.P$37(GND) U3.P$40(GND) U3.P$41(GND) U3.P$43(GND) U3.P$57(GND) U3.P$58(GND) U3.P$60(GND) U3.P$61(GND) U3.P$64(GND) U3.P$65(GND) U3.P$77(GND) U3.P$78(GND) U3.P$80(GND) ; also sheet 1,2,3,4,5,7
GPS_ANT: R38.2 U3.P$79(GPS_ANT)
MAIN_ANT: CON5.1(FEED) U3.P$59(MAIN_ANT)
N$16: R34.2 U3.P$71(UART_TXD)
N$17: Q2.1(B) R29.2 R30.1
N$20: Q3.1(B) R31.2 R32.1
N$21: LED3.A R33.1
N$22: LED3.C Q3.3(C)
N$26: ANT1.FEED R38.1 R39.1
N$27: R35.2 U3.P$68(UART_RXD)
N$28: R36.2 U3.P$67(UART_CTS)
N$29: R37.2 U3.P$66(UART_RTS)
NET_STATUS: R31.1 U3.P$51(GPIO1) ; also sheet 1
POWER_ON: Q2.3(C) U3.P$3(POWER_ON)
SIM_RESET: U3.P$18(USIM_RESET) ; also sheet 3
USIM_CLK: U3.P$19(USIM_CLK) ; also sheet 3
USIM_DATA: U3.P$17(USIM_DATA) ; also sheet 3
V_USIM: U3.P$20(V_USIM) ; also sheet 3
Unconnected: U3.P$4(RESET) U3.P$6(SPI_CLK) U3.P$7(SPI_MISO_DATA) U3.P$8(SPI_MOSI_DATA) U3.P$9(SPI_CS_N) U3.P$11(USB_VBUS) U3.P$12(USB_DM) U3.P$13(USB_DP) U3.P$15(RESERVED_1) U3.P$16(RESERVED_2) U3.P$21(SPK_M) U3.P$22(SPK_P) U3.P$23(MIC1P) U3.P$24(MIC1N) U3.P$25(EAR1N) U3.P$26(EAR1P) U3.P$27(KEYSENSE_N1) U3.P$28(KEYSENSE_N0) U3.P$29(KEYPAD_0) U3.P$30(KEYPAD_2) U3.P$31(KEYSENSE_N2) U3.P$32(KEYSENSE_N3) U3.P$33(KEYPAD_1) U3.P$34(KEYPAD_4) U3.P$35(KEYPAD_3) U3.P$36(KEYSENSE_N4) U3.P$42(VRTC) U3.P$44(VREG_AUX) U3.P$45(CURRENT_SINK) U3.P$46(ADC2) U3.P$47(ADC1) U3.P$48(GPIO44) U3.P$49(GPIO40) U3.P$50(GPIO43) U3.P$52(GPIO41) U3.P$53(GPIO42) U3.P$54(GPIO4) U3.P$55(I2C_SCL) U3.P$56(I2C_SDA) U3.P$69(UART_RI) U3.P$70(UART_DCD) U3.P$73(PCM_DOUT) U3.P$74(PCM_DIN) U3.P$75(PCM_SYNC) U3.P$76(PCM_CLK)

### Notes on the sheet
- 3G MODULE

## Sheet 7 of 7: EEPROM
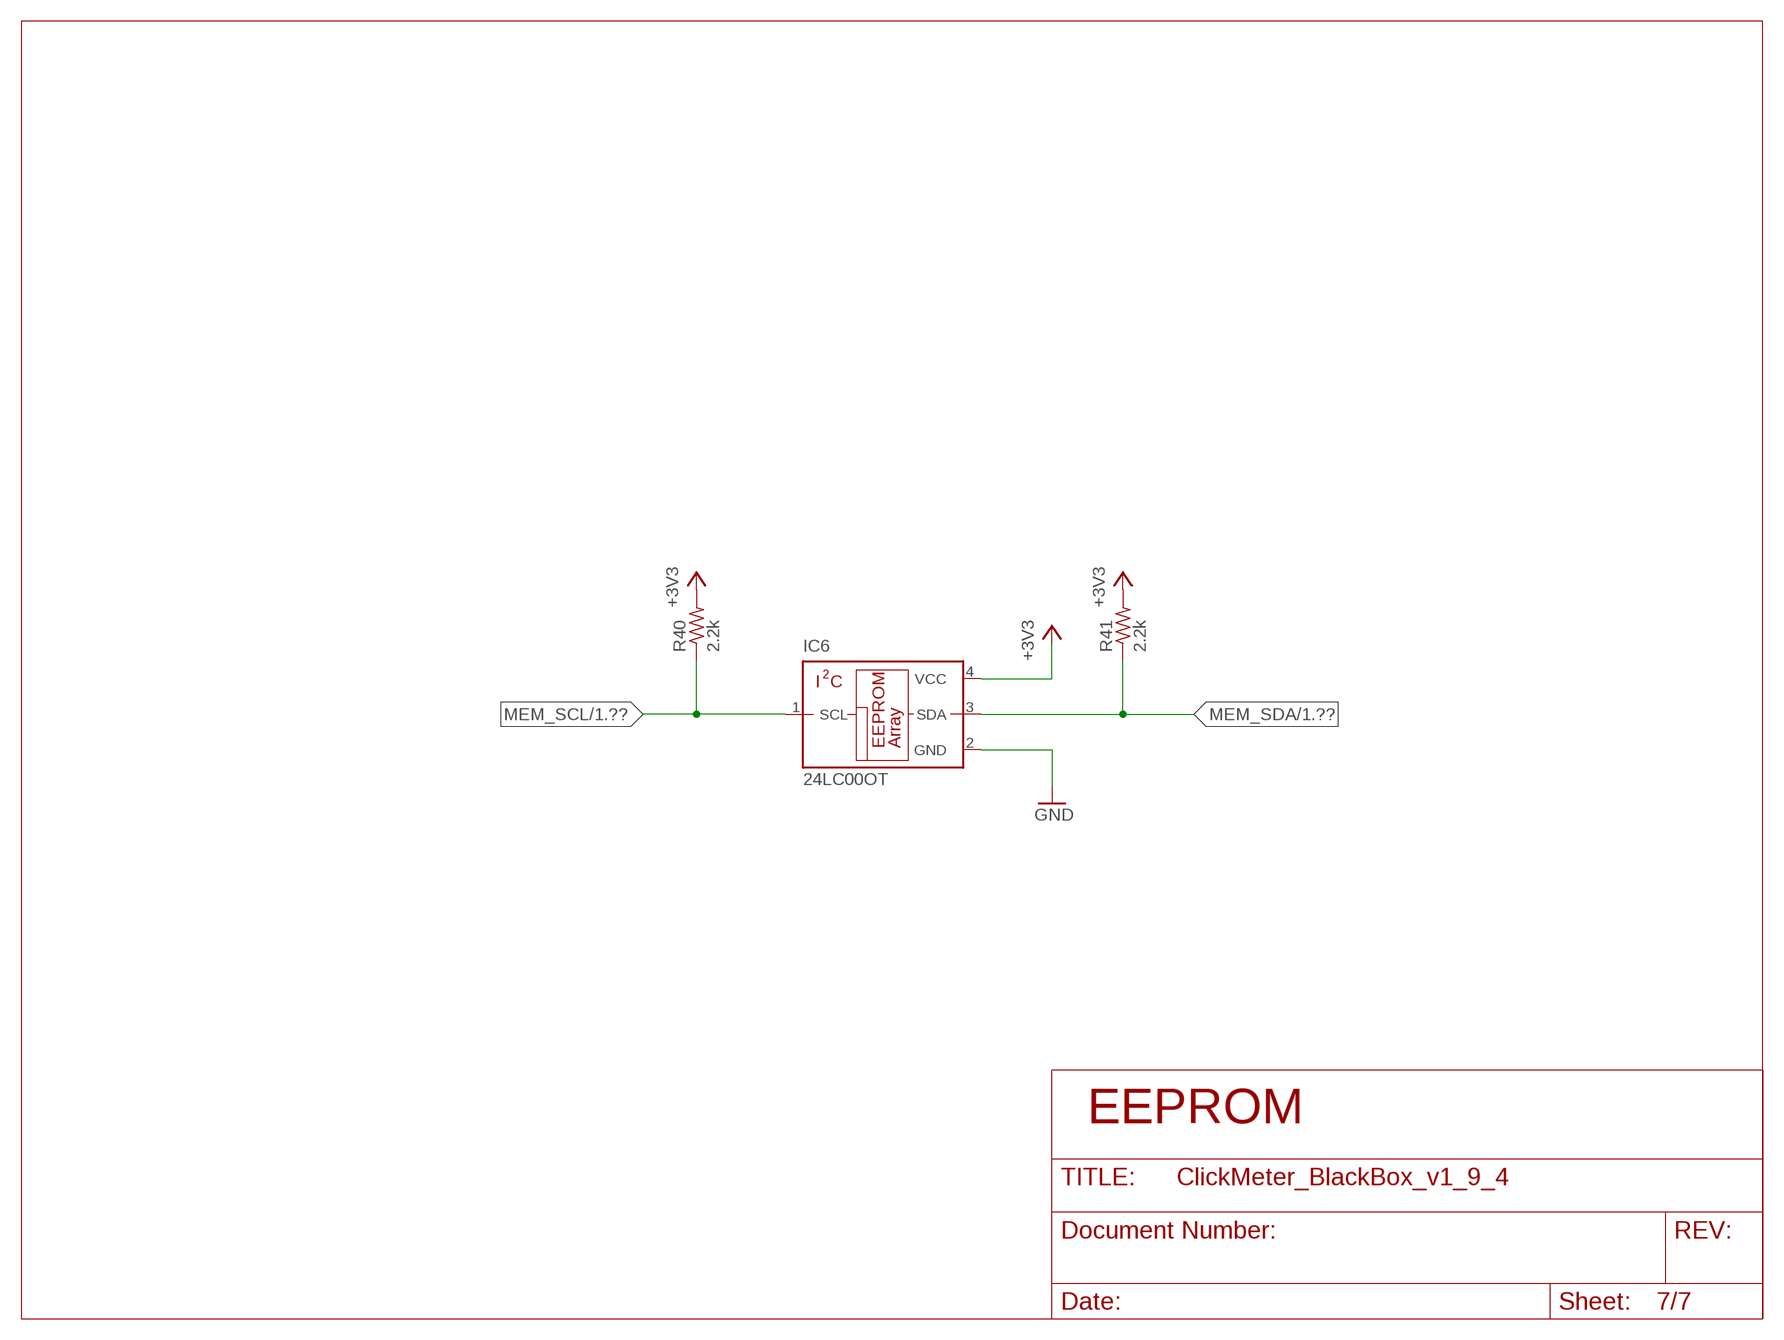
[diagram p6: schematic, sheet 7]

### Parts
IC6  24LC00OT  [SOT23-5L]
R40  2.2k  R-US_R0603  [R0603]
R41  2.2k  R-US_R0603  [R0603]

### Nets
+3V3: IC6.4(VCC) R40.2 R41.2 ; also sheet 1,2,3,4,5
GND: IC6.2(GND) ; also sheet 1,2,3,4,5,6
MEM_SCL: IC6.1(SCL) R40.1 ; also sheet 1
MEM_SDA: IC6.3(SDA) R41.1 ; also sheet 1

### Notes on the sheet
- EEPROM

## Library data of the parts
ANT1 = Johanson:1575AT43A0040E
BT1 = te-connectivity:PTS525_SM15
C1-C31 = resistor:C-US: CAPACITOR, American symbol
CON1 = ICSP:PICKIT_SMD
CON2 = con-molex:47346-1001
CON3 = SIM_CARD:MOLEX_78646-3001
CON4 = microsd:MOLEX_503182-1852
CON5 = RF_connector:A-1JA
F1-F4 = GeekAmmo:FIDUCIAL
FB1-FB5 = SparkFun-Passives:FB
IC1 = texas:LP38501
IC2 = custom_microchip:MIC5504-3.3YM5-TR
IC3 = custom_texas:TPS2041CDBVR
IC4 = custom_texas:SN65220DBVR
IC5 = on-semiconductor:SMF05CT2G
IC6 = microchip:24*00: Serial EEPROM 128 bit, I2C (AA = 1.8 V/LC = 2.5 V/C = 5.0 V); MF: MICROCHIP; MPN: 24LC00T-I/OT; OC_FARNELL: 9757864; OC_NEWARK: 62K0574
J1 = sf-bluegiga:CC-DEBUG: CC debugger connection with various form factors. 2x5-pin 0.05" pitch header does not include Pin 9 (VDD) supply connection in this part. https://github.com/jrowberg/sf-oshw Last updated 2014-01-04 by Jeff Rowberg <jeff@rowberg.net>
LED1 LED2 = kingbright:APTF1616SEEZGQBDC
LED3 = eagle-ltspice:LED_E: LED Source: http://www.osram.convergy.de Source: www.luxeon.com Source: www.kingbright.com; SPICEMODEL: NONE; SPICEPREFIX: D; SPICETYPE: diode
Q1 = transistor:BSR15
Q2 Q3 = transistor-npn:BCX70*: NPN Transistor
R1-R41 = resistor:R-US_: RESISTOR, American symbol
TP1-TP7 = testpad:PTR1: TEST PIN
U1 = microchip:PIC32MX695F512H-X_PT
U2 = sf-bluegiga:BLE112-VISUAL: Bluetooth Low Energy single-mode module - Bluetooth 4.0 (CC2540). BLE112-A variant has an on-module ceramic chip antenna, BLE112-E variant has U.Fl connector. BLE112-A variant includes keepout/restrict area. Antenna edge of the module should be flush up against the edge of the PCB. See datasheet for variant layout details. The BLE112 is a Bluetooth Smart module targeted for low-power sensors and accessories. It integrates all features required for a Bluetooth Smart application, including Bluetooth radio, software stack, and GATT-based profiles. The BLE112 Bluetooth Smart module can also host end-user applications, which means no external micro controller is required in size or price constrained devices. Morover, ithas flexible hardware interfaces to connect to different peripherals and sensors and can be powered directly from a standard 3V coin cell battery or a pair of AAA batteries. In the lowest power sleep mode it merely consumes 500 nA and will wake up within a few hundred microseconds. http://www.bluegiga.com/en-US/products/bluetooth-4.0-modules/ble112-bluetooth--smart-module https://github.com/jrowberg/sf-oshw Last updated 2014-01-04 by Jeff Rowberg <jeff@rowberg.net>; ANTENNA: On-module ceramic chip antenna
U3 = SIMCOM:SIM5320A
Y1 = SparkFun-FreqCtrl:CRYSTAL: Various standard crystals. Proven footprints.

## Board
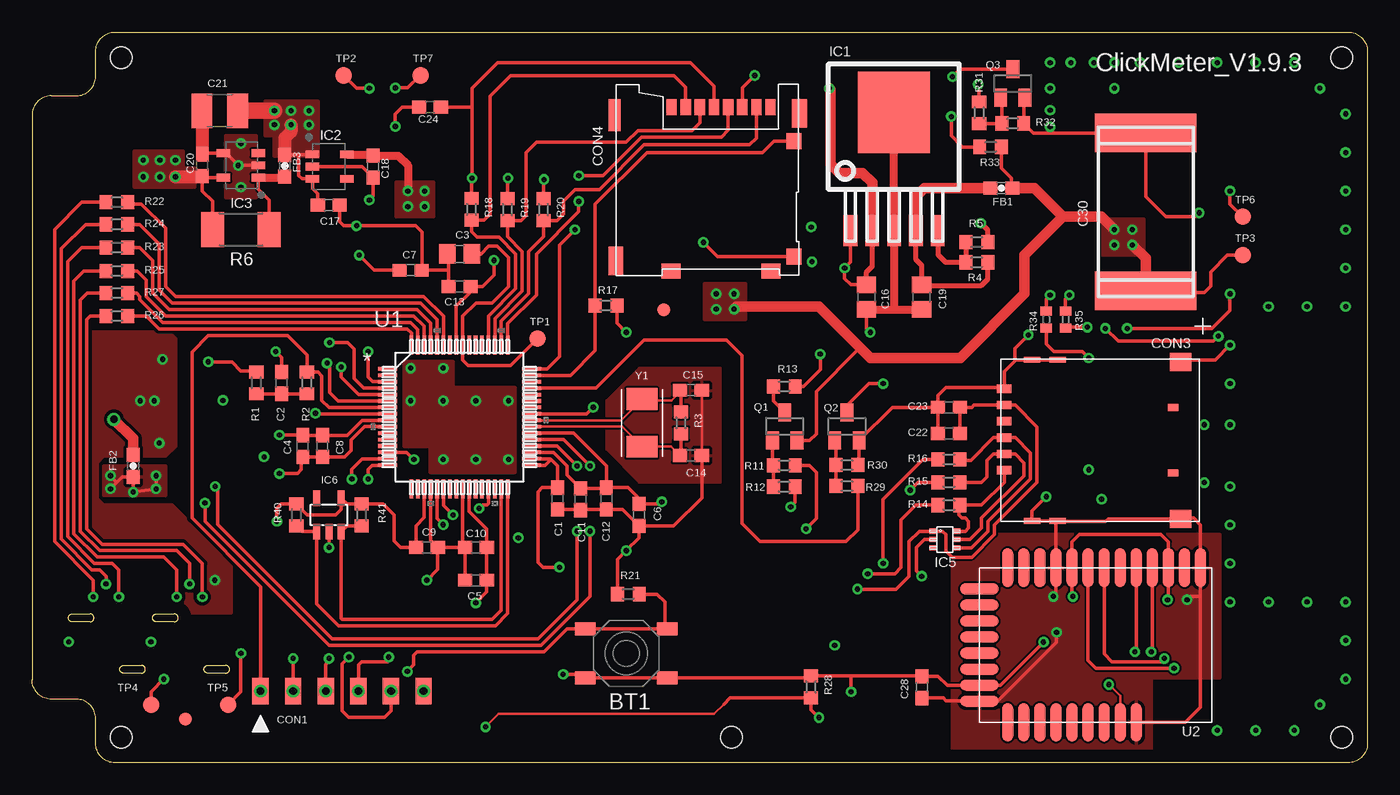
[diagram p7: board, top side]
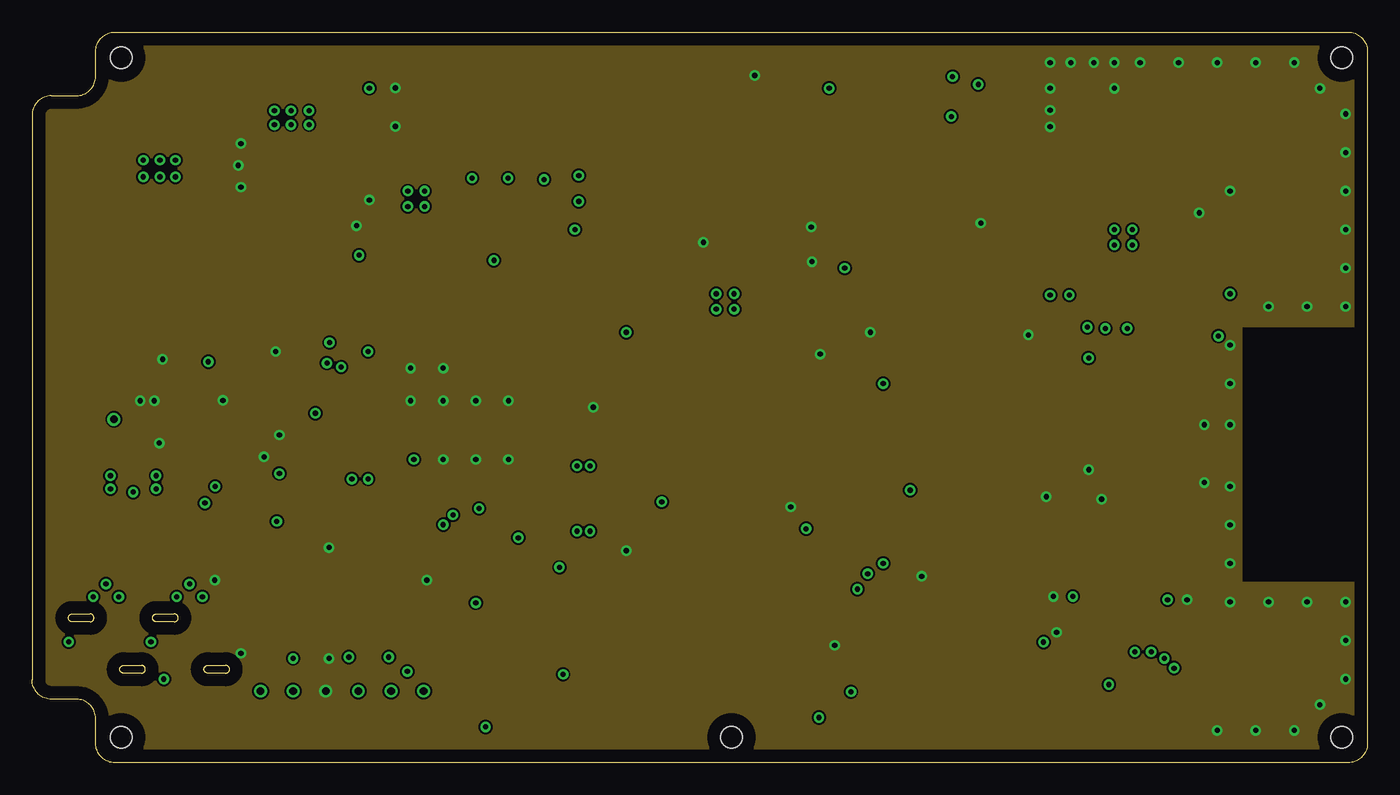
[diagram p8: board, inner layer Ground]
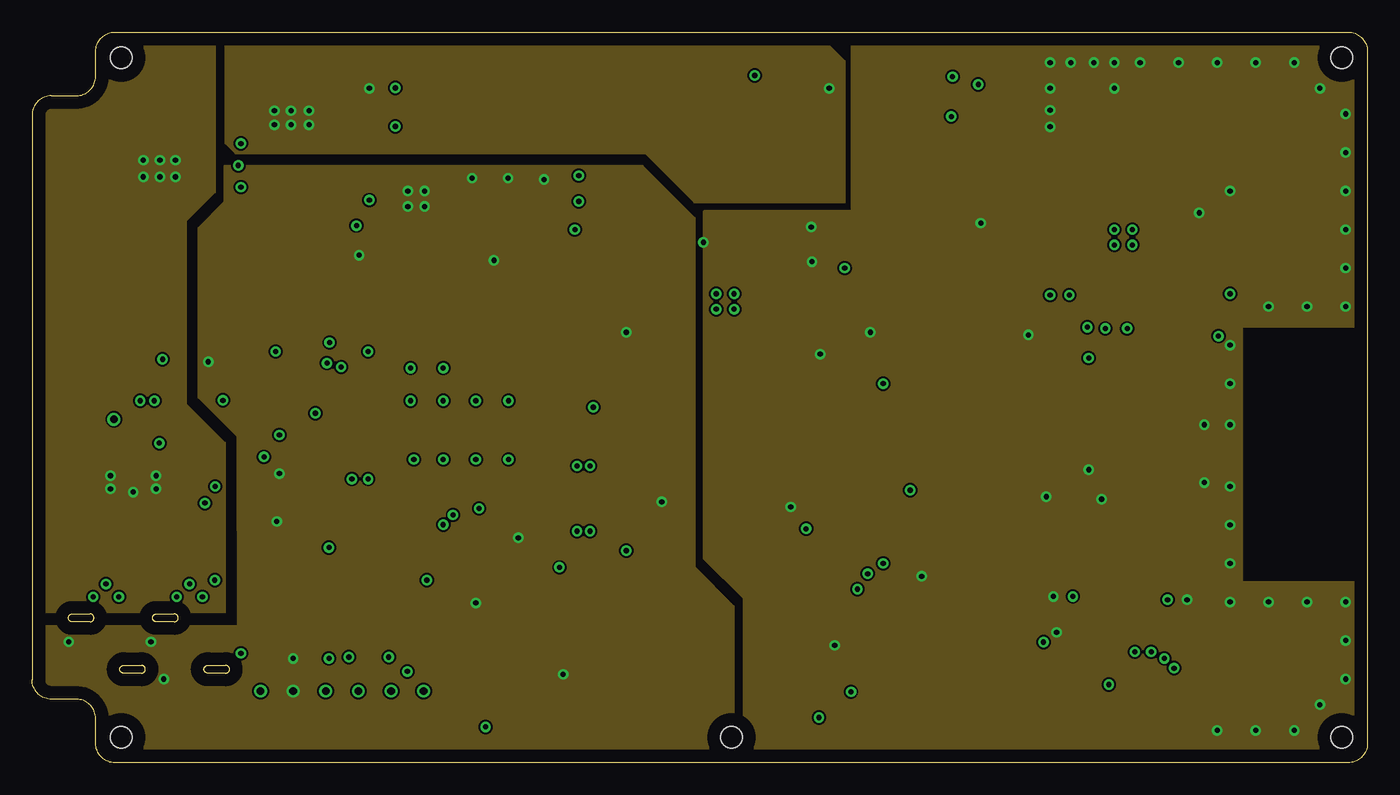
[diagram p9: board, inner layer V+]
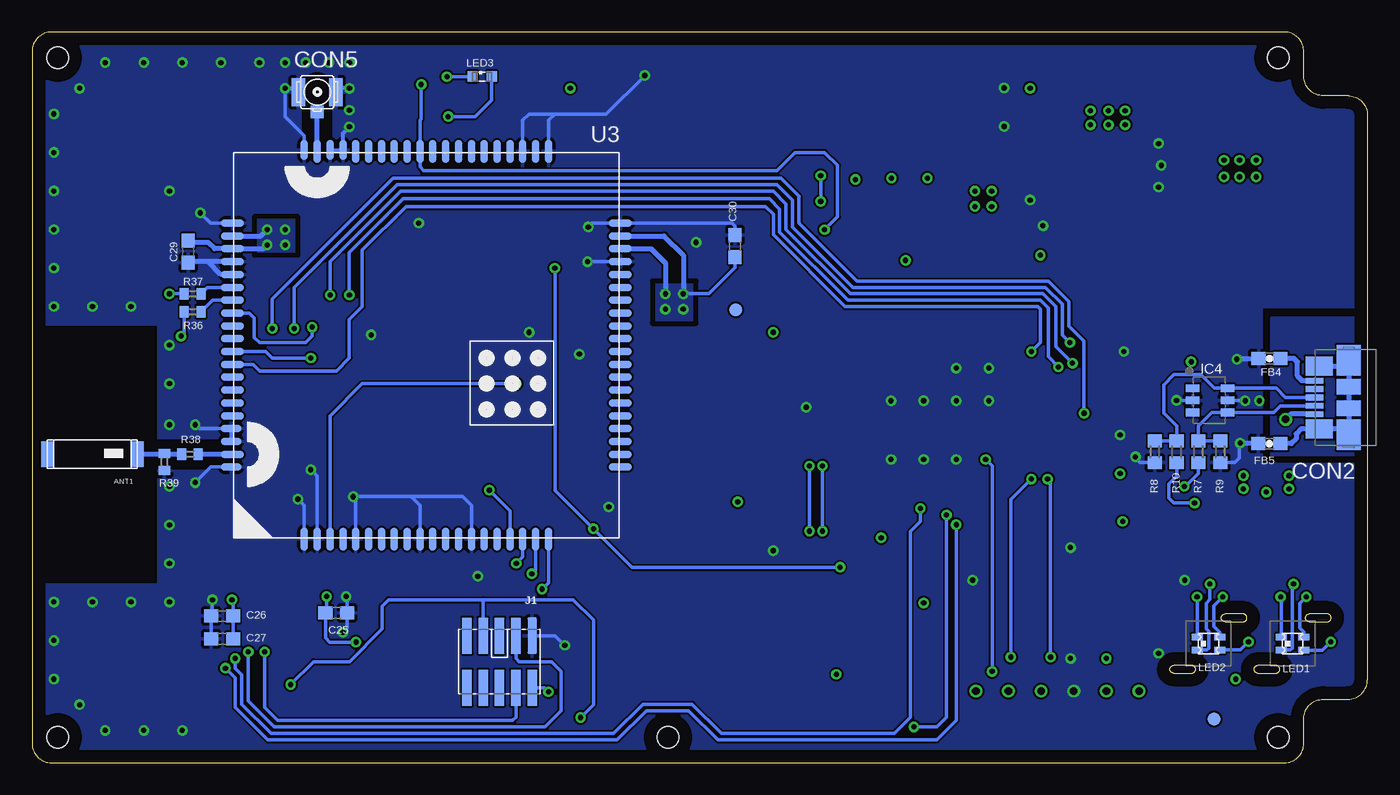
[diagram p10: board, bottom side, seen from below]

Size 103.95 x 56.9 mm. Coordinates in mm from the lower left corner, seen from the top.
Outline: 3.45,4.95 1.5,4.95 arc-90 0,6.45 0,50.45 arc-90 1.5,51.95 3.45,51.95 arc90 4.95,53.45 4.95,55.4 arc-90 6.45,56.9 102.45,56.9 arc-90 103.95,55.4 103.95,1.5 arc-90 102.45,0 6.45,0 arc-90 4.95,1.5 4.95,3.45 arc90 3.45,4.95
Copper layers (1+2*15+16): Top 0.035mm / dielectric 0.2mm / Ground 0.035mm / dielectric 0.5mm / V+ 0.035mm / dielectric 0.2mm / Bottom 0.035mm
Design rules "default *": minimum track width 8mil, minimum drill 0.3mm, track to track 6mil, track to pad 6mil, pad to pad 6mil, via to via 6mil, smd to smd 6mil, copper to edge 40mil, drill to drill 8mil, minimum pad ring 10mil, minimum via ring 8mil, stop-mask expansion 4mil, vias tented up to drill 20mil, thermal gap 10mil
Holes 1.7 mm at 6.95,54.9 6.95,2 54.45,2 101.95,2 101.95,54.9
bRestrict: 10 lines

### Footprints (pad centres in the part's own frame; a part is rotated, then mirrored left to right if it is on the bottom)
1575AT43A0040E = smd 1 x 2: FEED -3.5,0; NC 3.5,0
PTS525SM15SMTR2 = smd 1.6 x 1: 1 -3.2,1.9; 2 3.2,1.9; 3 -3.2,-1.9; 4 3.2,-1.9
C0603 = smd 1.1 x 1: 1 -0.85,0; 2 0.85,0
C0805 = smd 1.3 x 1.5: 1 -0.95,0; 2 0.95,0
C1210 = smd 1.6 x 2.7: 1 -1.4,0; 2 1.4,0
592D-2200 = smd 3 x 7.9: 1 -6.14,0; 2 6.14,0
SMD_PICKIT = smd 1.27 x 2.032: 1 -6.35,0; 2 -3.81,0; 3 -1.27,0; 4 1.27,0; 5 3.81,0; 6 6.35,0
47346-1001 = smd 1.38 x 0.45: 1 2.66,1.3; 2 2.66,0.65; 3 2.66,0; 4 2.66,-0.65; 5 2.66,-1.3 | smd 1.9 x 2.375: S1 0,2.913; S4 0,-2.913 | smd 1.9 x 1.175: S2 0,0.838; S3 0,-0.838 | smd 2.1 x 1.475: S5 2.3,2.462; S6 2.3,-2.462
MOLEX_78646-3001 = smd 1.15 x 0.65: C1 -7.13,2.97; C2 -7.13,0.43; C3 -7.13,-2.11; C5 -7.13,4.24; C6 -7.13,1.7; C7 -7.13,-0.84 | smd 1.3 x 0.45: GND1 -4.96,6.485; GND2 -2.96,6.485; GND3 -4.96,-6.055; GND4 -2.96,-6.055 | smd 1.7 x 1.4: GND5 6.6,6.32; GND6 6.6,-5.89 | smd 0.8 x 0.54: X1 6.02,2.76; X2 6.02,-2.32
MOLEX_503182-1852 = smd 0.8 x 1.24: 1 -16.51,2.54; 2 -15.41,2.54; 3 -14.31,2.54; 4 -13.21,2.54; 5 -12.11,2.54; 6 -11.01,2.54; 7 -9.91,2.54; 8 -8.81,2.54 | smd 1.16 x 1.25: DET -6.97,-9.09; SW -6.97,-0.09 | smd 0.95 x 2.5: X1 -20.955,1.91 | smd 1.15 x 2.2: X2 -20.855,-9.42; X3 -6.565,2.06 | smd 1.5 x 1.15: X4 -16.55,-10.215; X5 -8.77,-10.215
A-1JA = smd 0.99 x 0.99: 1 0,1.535 | smd 1.055 x 2.21: 2 -1.468,0; 3 1.468,0
FIDUCIAL = smd 1 x 1: P$1 0,0
0603 = smd 1.1 x 1: 1 -0.85,0; 2 0.85,0
TO-263-5 = smd 1.07 x 2.41: 1 -3.4,-7.2; 2 -1.7,-7.2; 3 0,-7.2; 4 1.7,-7.2; 5 3.4,-7.2 | smd 5.59 x 6.35: 6 0,2.025
SOT-23-5 = smd 0.6 x 1.05: 1 -0.95,-1.35; 2 0,-1.35; 3 0.95,-1.35; 4 0.95,1.35; 5 -0.95,1.35
SOT-23-6 = smd 0.6 x 1.05: 1 -0.95,-1.35; 2 0,-1.35; 3 0.95,-1.35; 4 0.95,1.35; 5 0,1.35; 6 -0.95,1.35
SC-88/SC70-6/SOT-363 = smd 0.5 x 0.4: 1 -1.27,0; 2 -1.27,-0.65; 3 -1.27,-1.3; 4 0.63,-1.3; 5 0.63,-0.65; 6 0.63,0
SOT23-5L = smd 0.55 x 1.2: 1 -0.95,-1.3; 2 0,-1.3; 3 0.95,-1.3; 4 0.95,1.3; 5 -0.95,1.3
CC-P05 = smd 0.74 x 2.8: 1 -2.54,-2.03; 2 -2.54,2.03; 3 -1.27,-2.03; 4 -1.27,2.03; 5 0,-2.03; 6 0,2.03; 7 1.27,-2.03; 8 1.27,2.03; 9 2.54,-2.03; 10 2.54,2.03
APTF1616SEEZGQBDC = smd 0.85 x 0.5: 1 0.875,-0.5; 2 -0.875,-0.5; 3 -0.875,0.5; 4 0.875,0.5
LED_SML0603 = smd 0.8 x 0.8: A 0.75,0; C -0.75,0
SOT23 = smd 1 x 1.4: 1 -0.95,-1.1; 2 0.95,-1.1; 3 0,1.1
R0603 = smd 1 x 1.1: 1 -0.85,0; 2 0.85,0
R2010 = smd 1.8 x 2.7: 1 -2.2,0; 2 2.2,0
R0402 = smd 0.7 x 0.9: 1 -0.65,0; 2 0.65,0
B1,27 = smd 1.27 x 1.27: TP 0,0
TQFP64_10X10MC = smd 1.473 x 0.279: 1 -5.613,3.75; 2 -5.613,3.25; 3 -5.613,2.75; 4 -5.613,2.25; 5 -5.613,1.75; 6 -5.613,1.25; 7 -5.613,0.75; 8 -5.613,0.25; 9 -5.613,-0.25; 10 -5.613,-0.75; 11 -5.613,-1.25; 12 -5.613,-1.75; 13 -5.613,-2.25; 14 -5.613,-2.75; 15 -5.613,-3.25; 16 -5.613,-3.75; 33 5.613,-3.75; 34 5.613,-3.25; 35 5.613,-2.75; 36 5.613,-2.25; 37 5.613,-1.75; 38 5.613,-1.25; 39 5.613,-0.75; 40 5.613,-0.25; 41 5.613,0.25; 42 5.613,0.75; 43 5.613,1.25; 44 5.613,1.75; 45 5.613,2.25; 46 5.613,2.75; 47 5.613,3.25; 48 5.613,3.75 | smd 0.279 x 1.473: 17 -3.75,-5.613; 18 -3.25,-5.613; 19 -2.75,-5.613; 20 -2.25,-5.613; 21 -1.75,-5.613; 22 -1.25,-5.613; 23 -0.75,-5.613; 24 -0.25,-5.613; 25 0.25,-5.613; 26 0.75,-5.613; 27 1.25,-5.613; 28 1.75,-5.613; 29 2.25,-5.613; 30 2.75,-5.613; 31 3.25,-5.613; 32 3.75,-5.613; 49 3.75,5.613; 50 3.25,5.613; 51 2.75,5.613; 52 2.25,5.613; 53 1.75,5.613; 54 1.25,5.613; 55 0.75,5.613; 56 0.25,5.613; 57 -0.25,5.613; 58 -0.75,5.613; 59 -1.25,5.613; 60 -1.75,5.613; 61 -2.25,5.613; 62 -2.75,5.613; 63 -3.25,5.613; 64 -3.75,5.613
BLE112-A = smd 3 x 0.85: AVDD -6.05,6.9; AVDD@2 -6.05,5.65; GND -6.05,8.15; GND@2 -6.05,-3.1; GND@4 6,3.15; P0_0 6,0.65; P0_1 6,-0.6; P0_2 6,-1.85; P0_3 6,-3.1; P0_4 6,-4.35; P0_5 6,-5.6; P0_6 6,-6.85; P1_5 -6.05,-6.85; P1_6 -6.05,-0.6; P1_7 -6.05,0.65; P2_0 -6.05,1.9; P2_1 -6.05,3.15; P2_2 -6.05,4.4; RESET 6,1.9; USB+ -6.05,-4.35; USB- -6.05,-5.6; VDD_USB -6.05,-1.85 | smd 0.85 x 3: DVDD 3.1,-9.05; GND@3 4.35,-9.05; P0_7 1.85,-9.05; P1_0 0.6,-9.05; P1_1 -0.65,-9.05; P1_2 -1.9,-9.05; P1_3 -3.15,-9.05; P1_4 -4.4,-9.05
SIM5320A = smd 1.8 x 0.6: P$1 -15.1,9.5; P$2 -15.1,8.5; P$3 -15.1,7.5; P$4 -15.1,6.5; P$5 -15.1,5.5; P$6 -15.1,4.5; P$7 -15.1,3.5; P$8 -15.1,2.5; P$9 -15.1,1.5; P$10 -15.1,0.5; P$11 -15.1,-0.5; P$12 -15.1,-1.5; P$13 -15.1,-2.5; P$14 -15.1,-3.5; P$15 -15.1,-4.5; P$16 -15.1,-5.5; P$17 -15.1,-6.5; P$18 -15.1,-7.5; P$19 -15.1,-8.5; P$20 -15.1,-9.5; P$41 15.1,-9.5; P$42 15.1,-8.5; P$43 15.1,-7.5; P$44 15.1,-6.5; P$45 15.1,-5.5; P$46 15.1,-4.5; P$47 15.1,-3.5; P$48 15.1,-2.5; P$49 15.1,-1.5; P$50 15.1,-0.5; P$51 15.1,0.5; P$52 15.1,1.5; P$53 15.1,2.5; P$54 15.1,3.5; P$55 15.1,4.5; P$56 15.1,5.5; P$59 15.1,8.5 | smd 0.6 x 1.8: P$21 -9.5,-15.1; P$22 -8.5,-15.1; P$23 -7.5,-15.1; P$24 -6.5,-15.1; P$25 -5.5,-15.1; P$26 -4.5,-15.1; P$27 -3.5,-15.1; P$28 -2.5,-15.1; P$29 -1.5,-15.1; P$30 -0.5,-15.1; P$31 0.5,-15.1; P$32 1.5,-15.1; P$33 2.5,-15.1; P$34 3.5,-15.1; P$35 4.5,-15.1; P$36 5.5,-15.1; P$37 6.5,-15.1; P$38 7.5,-15.1; P$39 8.5,-15.1; P$40 9.5,-15.1; P$61 9.5,15.1; P$62 8.5,15.1; P$63 7.5,15.1; P$64 6.5,15.1; P$65 5.5,15.1; P$66 4.5,15.1; P$67 3.5,15.1; P$68 2.5,15.1; P$69 1.5,15.1; P$70 0.5,15.1; P$71 -0.5,15.1; P$72 -1.5,15.1; P$73 -2.5,15.1; P$74 -3.5,15.1; P$75 -4.5,15.1; P$76 -5.5,15.1; P$79 -8.5,15.1 | smd 1.6 x 0.6: P$57 15.2,6.5; P$58 15.2,7.5; P$60 15.2,9.5 | smd 0.6 x 1.6: P$77 -6.5,15.2; P$78 -7.5,15.2; P$80 -9.5,15.2
CRYSTAL-TXC-7A = smd 1.7 x 2.4: P$1 1.85,0; P$2 -1.85,0

### Placement (x,y rotation side)
ANT1  99.25,24.02 180 bottom
BT1  46.25,8.52 0 top
C1  40.89,20.57 270 top
C2  19.43,29.58 90 top
C3  33.27,39.62 180 top
C4  21.08,24.65 90 top
C5  34.54,14.22 180 top
C6  47.24,19.3 270 top
C7  29.46,38.35 0 top
C8  22.61,24.65 90 top
C9  30.73,16.76 0 top
C10  34.54,16.76 180 top
C11  42.7,20.52 270 top
C12  44.7,20.57 270 top
C13  33.27,37.08 180 top
C14  51.28,23.93 0 top
C15  51.28,29.01 0 top
C16  64.95,36.26 270 top
C17  23.1,43.42 0 top
C18  26.55,46.42 270 top
C19  69.24,36.26 270 top
C20  13.25,46.52 90 top
C21  14.6,50.76 180 top
C22  71.37,25.65 180 top
C23  71.37,27.69 180 top
C24  30.97,51.06 180 top
C25  80.26,11.68 0 bottom
C26  89.15,11.43 180 bottom
C27  89.15,9.65 180 bottom
C28  69.27,5.9 270 top
C29  91.8,39.8 270 bottom
C30  49.23,40.24 90 bottom
C31  86.69,42.9 90 top
CON1  24.13,5.59 0 top
CON2  1.45,28.45 180 bottom
CON3  82.8,24.89 0 top
CON4  66.29,48.51 0 top
CON5  81.75,52.22 180 bottom
F1  49.16,35.27 0 bottom
F2  11.95,3.41 0 bottom
F3  49.16,35.27 0 top
F4  11.95,3.41 0 top
FB1  75.45,44.75 180 top
FB2  7.87,23.11 90 top
FB3  19.67,46.48 270 top
FB4  7.62,31.48 180 bottom
FB5  7.63,24.85 180 bottom
IC1  67.1,48.63 0 top
IC2  23.15,46.42 270 top
IC3  16.25,46.52 90 top
IC4  12.25,28.22 270 bottom
IC5  71.37,18.03 0 top
IC6  23.11,19.3 0 top
J1  67.56,7.87 180 bottom
LED1  5.82,9.29 0 bottom
LED2  12.37,9.29 0 bottom
LED3  68.91,53.44 0 bottom
Q1  58.58,26.19 0 top
Q2  63.43,26.19 0 top
Q3  76.34,52.89 0 top
R1  17.46,29.58 270 top
R2  21.39,29.58 270 top
R3  50.52,26.47 90 top
R4  73.54,38.97 180 top
R5  73.54,40.55 0 top
R6  16.25,41.52 0 top
R7  13.15,24.22 90 bottom
R8  14.85,24.22 90 bottom
R9  11.45,24.22 90 bottom
R10  16.55,24.22 270 bottom
R11  58.56,23.16 180 top
R12  58.55,21.51 0 top
R13  58.56,29.32 0 top
R14  71.37,20.07 180 top
R15  71.37,21.84 180 top
R16  71.37,23.62 180 top
R17  44.67,35.61 0 top
R18  34.2,43.11 90 top
R19  37,43.08 90 top
R20  39.8,43.08 90 top
R21  46.41,13.13 0 top
R22  6.6,43.65 180 top
R23  6.6,40.12 180 top
R24  6.6,41.93 180 top
R25  6.6,38.3 180 top
R26  6.6,34.79 180 top
R27  6.6,36.58 180 top
R28  60.64,5.92 90 top
R29  63.43,21.55 180 top
R30  63.43,23.18 0 top
R31  73.73,50.61 270 top
R32  76.34,49.78 0 top
R33  74.61,47.96 0 top
R34  78.95,34.52 270 top
R35  80.45,34.52 270 top
R36  91.45,35.12 0 bottom
R37  91.45,36.52 0 bottom
R38  91.65,24.02 0 bottom
R39  93.65,23.42 270 bottom
R40  20.57,19.3 90 top
R41  25.65,19.3 90 top
TP1  39.35,33.02 0 top
TP2  24.25,53.52 0 top
TP3  94.25,39.52 0 top
TP4  9.25,4.52 0 top
TP5  15.25,4.52 0 top
TP6  94.25,42.52 0 top
TP7  30.25,53.52 0 top
U1  33.27,26.92 0 top
U2  82.8,9.14 270 top
U3  73.25,32.52 90 bottom
Y1  47.47,26.47 90 top

### Tracks (layer width: path | path; a pad name or v marks a point on that pad's centre or on a via)
3G_CTS  (via drill 0.4)
  Top 0.254: v22.05,27.22 22.1,27.17 U1.8 | v93.25,36.52 93.25,35.22 91.85,33.82 v85.25,33.82
  Bottom 0.254: v22.05,27.22 22.05,32.82 23.25,34.02 23.25,35.92 24.85,37.52 39.75,37.52 44.25,42.02 44.25,44.12 45.65,45.52 75.85,45.52 85.25,36.12 v85.25,33.82 | R37.1 v93.25,36.52
3G_DTR  (via drill 0.4)
  Top 0.254: v26.15,32.02 26.15,30.02 26.5,29.67 U1.3
  Bottom 0.254: v26.15,32.02 25.45,32.72 25.45,35.32 25.65,35.52 40.65,35.52 46.25,41.12 46.25,42.72 46.85,43.32 74.85,43.32 78.25,39.92 78.25,35.52 79.25,34.52 79.25,31.52 80.25,30.52 86.25,30.52 86.75,31.02 U3.P$72
3G_POWER_ON
  Top 0.254: R29.1 64.28,18.15 63.35,17.22 56.65,17.22 55.25,18.62 55.25,31.72 54.05,32.92 47.65,32.92 43.9,29.17 U1.45
3G_RTS  (via drill 0.4)
  Top 0.254: v23.15,32.72 24.55,32.72 25.05,32.22 25.05,29.92 25.8,29.17 U1.4 | v92.35,33.22 91.95,32.82 84.55,32.82 v83.55,33.82
  Bottom 0.254: v23.15,32.72 23.75,33.32 23.75,35.72 25.05,37.02 40.05,37.02 44.75,41.72 44.75,43.82 45.95,45.02 75.55,45.02 83.55,37.02 v83.55,33.82 | v92.35,33.22 92.1,33.47 R36.1
3G_RX  (via drill 0.4)
  Top 0.254: v24.05,30.82 24.05,30.02 25.4,28.67 U1.5 | R34.1 78.95,36.12 v79.25,36.42
  Bottom 0.254: v24.05,30.82 24.85,31.62 24.85,35.42 25.45,36.02 40.45,36.02 45.75,41.32 45.75,43.12 46.55,43.92 75.05,43.92 79.25,39.72 v79.25,36.42
3G_TX  (via drill 0.4)
  Top 0.203: 27.64,28.19 U1.6
  Top 0.254: v22.95,31.12 23.15,30.92 23.15,28.82 23.8,28.17 U1.6 | R35.1 80.45,36.12 v80.75,36.42
  Bottom 0.254: v22.95,31.12 24.25,32.42 24.25,35.52 25.25,36.52 40.25,36.52 45.25,41.52 45.25,43.52 46.25,44.52 75.25,44.52 80.75,39.02 v80.75,36.42
+3V3  (via drill 0.4, 0.6)
  Top 0.203: 42.93,21.6 C11.1 | U2.AVDD@2 U2.AVDD
  Top 0.254: 27.65,26.16 U1.10 25.9,26.17 24.85,25.12 24.85,24.32 24.33,23.8 C8.1 C4.1 20.95,23.68 20.95,22.82 20.65,22.52 v19.25,22.52 | U1.26 34.04,21.3 34.04,19.56 35.39,18.2 C10.1 C5.1 35.39,13.3 v34.54,12.45 | U1.19 30.52,19.09 29.88,18.45 C9.1 28.7,16.76 28.19,17.27 28.19,19.3 27.34,20.15 R41.2 24.51,20.15 IC6.4 24.06,19.75 23.62,19.3 21.42,19.3 R40.2 19.39,20.15 19.05,19.81 v19.05,18.8 | U1.57 33.02,35.56 34.12,36.66 C13.1 35.05,37.08 35.95,37.99 v35.95,39.12 | C12.1 44.7,23.11 42.14,25.67 U1.38 38.91,25.65 | C12.1 46.39,21.42 47.24,20.57 C6.1 48.86,20.15 v49.02,20.32 | 28.19,38.35 C7.1 26.62,38.35 v25.45,39.52 | C11.1 44.65,21.37 C12.1 | v78.74,9.4 75.39,6.04 U2.DVDD 73.73,6.02 71.25,6.02 70.53,6.75 C28.1 69.25,6.77 63.75,6.77 | v81.03,12.95 80.95,13.03 U2.VDD_USB 80.95,17.2 81.53,17.78 87.88,17.78 88.45,17.21 U2.AVDD@2 88.45,12.76 v88.39,12.7 | CON1.2 v20.32,8.13 | C11.1 42.67,21.4 | U1.35 40.6,24.17 41.66,23.11 41.66,22.41 C11.1 | v13.72,31.23 14.72,31.21 15.57,31.21 16.25,30.52 17.37,30.52 R1.1 | R18.2 34.2,45.47 v34.25,45.52 34.25,51.02 | R19.2 37,45.47 v37.05,45.52 | R20.2 39.8,45.37 v39.85,45.42 | CON4.4 53.08,52.69 51.25,54.52 36.25,54.52 34.25,52.52 34.25,51.02 | C24.1 34.22,51.06 34.25,51.02 | R17.2 45.52,34.26 v46.25,33.52 | v41.34,6.89 42.79,6.89 BT1.3 BT1.4 60.49,6.62 R28.2 63.75,6.77 | v63.75,5.52 63.75,6.77 | TP4.TP 9.25,5.52 v10.25,6.52 | 26.45,47.37 C18.1
  Top 0.61: IC2.5 26.45,47.37 | C18.1 28.5,47.27 29.25,46.52 v29.25,44.52
  V+ 0.254: v13.72,31.23 13.72,31.21
  Bottom 0.254: v78.74,9.4 80.77,9.4 81.11,9.74 C25.1 81.03,11.77 v81.03,12.95 | C27.1 C26.1 88.3,12.61 v88.39,12.7 | 20.08,7.89 v20.32,8.13 | J1.2 64.07,5.84 v63.75,5.52 | 11.45,8.74 LED2.1 9.89,8.79 v9.25,9.42 | LED1.1 3.5,8.78 v2.85,9.42
  other vias: 37.85,17.53 20.32,5.59 30.55,44.52 30.55,43.32 29.25,43.32
  pour V+: 14.99,46.47 14.99,43.69 12.95,41.66 12.95,28.45 16,25.4 16.05,10.62 -0.05,10.62 -0.05,6.42 arc90 1.45,4.92 3.45,4.92 arc-90 4.95,3.42 4.95,1.5 arc90 6.45,0 16,0 54.59,-0.01 54.61,12.19 51.56,15.24 51.56,42.42 47.51,46.47 21.84,46.47 20.07,46.47
  pour Top: 28.35,45.02 28.35,42.52 31.25,42.52 31.25,45.22 28.35,45.22
+3V9  (via drill 0.4)
  Top 0.254: R33.2 75.46,46.31 76.25,45.52 76.25,44.8 FB1.1 | Q1.2 60.52,25.09 61.05,25.62 61.05,28.92 64.25,32.12 64.25,32.52 | TP3.TP 93.05,39.52 91.75,38.22 91.75,37.12 91.25,36.62 86.83,36.62 C31.1
  Top 0.813: FB1.1 78.02,44.75 80.25,42.52 | 86.46,36.52 C31.1 86.69,39.28 v85.65,40.32 | v54.65,35.32 54.85,35.52 61.25,35.52 64.25,32.52 65.25,31.52 72.25,31.52 77.25,36.52 77.25,39.52 80.25,42.52 | 80.25,42.52 83.25,42.52 v84.25,41.52
  Bottom 0.254: C30.1 49.23,38.55 51.25,36.52 v53.25,36.52
  Bottom 0.406: v85.65,40.32 85.95,40.02 U3.P$63 89.75,40.02 90.25,40.52 91.67,40.52 C29.1 | U3.P$62 86.15,41.02 v85.65,41.52 | U3.P$39 54.75,41.02 53.25,39.52 v53.25,36.52 | U3.P$38 55.75,40.02 54.65,38.92 v54.65,36.52
  other vias: 84.25,40.32 53.25,35.32
  pour Top: 52.45,37.32 55.55,37.32 55.55,34.52 52.35,34.52 52.35,37.32
  pour Top: 83.35,42.32 86.55,42.32 86.55,39.52 83.35,39.52
  pour Bottom (no thermals): 83.25,42.52 86.65,42.52 86.65,39.52 83.25,39.52
  pour Bottom (no thermals): 52.25,37.52 55.65,37.52 55.65,34.22 52.25,34.22
+5V  (via drill 0.4)
  Top 0.254: TP2.TP 25.25,52.52 v26.25,52.52 | U1.34 40.33,23.67 40.39,23.62 | 40.39,23.62 40.89,23.11 C1.1 39.71,21.42 39.37,21.08 39.37,15.62 39.77,15.22 v41.05,15.22 | U1.33 39.94,23.17 40.39,23.62 | R11.1 60.51,23.16 61.05,22.62 61.05,19.02 v60.25,18.22 | IC1.1 63.7,38.97 v63.25,38.52 63.25,37.72 63.75,37.22 C16.1 | IC2.1 20.75,47.37 | 20.75,47.37 19.81,47.37 FB3.1 | 20.75,47.37 20.75,45.72 21,45.47 IC2.3 21.85,45.42 21.85,44.72 22.25,44.33 C17.1
  Top 0.406: C16.1 64.95,38.22 65.4,38.67 IC1.2
  Top 0.813: IC1.2 65.4,45.17 64.65,45.92 62.85,45.92 62.15,46.62 62.15,52.42 v62.05,52.52 | 19.65,47.35 FB3.1 | 18.84,50.76 v18.86,50.78
  Top 1.016: v20.16,49.68 20.16,49.13 19.67,48.64 FB3.1
  Top 1.27: C21.1 18.84,50.76
  Bottom 0.254: v41.05,15.22 57.25,15.22 v60.25,18.22 63.25,21.22 v63.25,38.52
  other vias: 20.16,50.78 21.56,50.78 18.86,49.68 21.56,49.68
  pour V+: 51.58,43.67 47.77,47.48 15.84,47.48 15.08,48.24 15.08,56.97 60.95,56.92 63.25,54.62 63.25,43.67
  pour Top (no thermals): 18.25,51.52 22.25,51.52 22.25,47.22 18.85,47.22 18.85,48.82 18.15,48.82 18.15,51.52
BT_RESET  (via drill 0.4)
  Top 0.203: U2.RESET 84.7,5.21 v83.82,6.1 | 53.85,4.57 53.09,3.81 36.32,3.81 v35.31,2.79
  Top 0.254: U1.22 32.02,20.05 v32.77,19.3 | 53.85,4.57 54.34,5.07 R28.1 60.64,4.14 v61.25,3.52
  Bottom 0.254: v83.82,6.1 82.04,7.87 79.25,7.87 76.71,10.41 76.71,12.19 76.2,12.7 68.83,12.7 | v32.77,19.3 32.77,3.56 33.53,2.79 v35.31,2.79 | J1.7 68.83,12.7 | 68.83,12.7 61.83,12.7 60.25,11.12 60.25,4.52 v61.25,3.52
BT_RX  (via drill 0.4)
  Top 0.254: U2.P1_6 82.2,7.97 82.8,7.37 v88.9,7.37 | v32,18.54 31.52,19.02 U1.21
  Bottom 0.254: v88.9,7.37 88.14,6.6 88.14,4.32 85.6,1.78 58.42,1.78 56.13,4.06 52.83,4.06 50.55,1.78 33.53,1.78 32,3.3 v32,18.54
BT_TX  (via drill 0.4)
  Top 0.254: U2.P1_7 83.45,8.49 84.07,7.87 87.88,7.87 v88.14,8.13 | U1.29 35.52,20.18 35.43,20.09 35.08,20.09 v34.8,19.81
  Bottom 0.254: v88.14,8.13 88.14,7.37 87.63,6.86 87.63,4.57 85.34,2.29 58.67,2.29 56.39,4.57 52.58,4.57 50.29,2.29 36.83,2.29 35.56,3.56 35.56,18.03 34.8,18.8 v34.8,19.81
BUTTON  (via drill 0.4)
  Top 0.254: v29.21,7.11 29.72,7.62 29.72,8.38 29.97,8.64 39.87,8.64 41.65,10.42 BT1.1 BT1.2 49.25,10.62 49.25,12.52 48.64,13.13 R21.2 | v29.72,23.62 29.17,24.17 U1.14
  Bottom 0.254: v29.21,7.11 29.21,23.11 v29.72,23.62
CC_DC  (via drill 0.4)
  Top 0.254: U2.P2_2 87.2,8.72 v87.12,8.64
  Bottom 0.254: v87.12,8.64 87.12,4.83 85.09,2.79 64.02,2.79 62.75,4.06 62.75,7.11 63.52,7.87 66.04,7.87 66.29,8.13 J1.3
CC_DD  (via drill 0.4)
  Top 0.254: U2.P2_1 85.95,8.74 v85.85,8.64
  Bottom 0.254: v85.85,8.64 85.85,4.32 84.84,3.3 66.55,3.3 66.29,3.56 J1.4
D+  (via drill 0.4)
  Top 0.254: v43.43,18.03 43.43,12.95 39.62,9.14 23.11,9.14 13.45,18.8 v13.45,20.22 | v43.43,23.11 41.37,25.17 U1.37
  Bottom 0.254: v43.43,18.03 v43.43,23.11 | R8.1 14.85,22.32 15.45,21.72 15.45,20.62 15.05,20.22 v13.45,20.22
D-  (via drill 0.4)
  Top 0.254: v42.42,18.03 42.42,12.7 39.37,9.65 23.37,9.65 14.46,18.56 14.46,21.32 v14.25,21.52 | v42.42,23.11 40.86,24.67 U1.36
  Bottom 0.254: v42.42,18.03 v42.42,23.11 | R7.1 13.15,22.52 14.15,21.52 v14.25,21.52
GND  (via drill 0.4, 0.6)
  Top 0.203: C14.2 C15.2 | 75.6,29.21 CON3.C5 | 79.89,18.8 CON3.GND4 79.7,18.7 | CON3.GND5 89.24,31.38 | 89.45,19.05 CON3.GND6 | 90.93,15.17 U2.GND | U2.GND@3 75.15,4.79
  Top 0.254: U1.9 | C10.2 33.52,16.93 U1.25 | C10.2 C5.2 | C3.2 32.42,39.52 32.42,38.35 | 32.42,38.35 C13.2 | C14.2 52.13,20.64 49.95,18.45 C6.2 | C1.2 42.65,19.72 | 42.65,19.72 C11.2 | 42.65,19.72 C12.2 45.97,19.72 C6.2 | U1.41 43.18,27.17 v43.69,27.69 | C9.2 31.58,15.07 v30.73,14.22 | C9.2 31.02,17.32 U1.20 | C9.2 C10.2 | 32.42,38.35 C7.2 30.35,38.39 30.35,41.32 29.85,41.82 v25.25,41.82 24.25,41.82 23.95,42.13 C17.2 | U1.9 | IC6.2 v23.11,16.76 | C23.2 C22.2 | CON3.GND2 CON3.GND1 76.59,31.38 76.5,31.28 | CON3.GND4 CON3.GND3 77.84,19.61 v78.95,20.72 | IC5.2 69.45,17.38 68.83,16.76 68.83,14.94 v69.25,14.52 | C23.2 70.52,28.61 71.12,29.21 75.6,29.21 | CON3.GND6 83.77,19 83.57,18.8 79.89,18.8 | CON3.C5 75.67,30.46 76.5,31.28 | 79.7,18.7 U2.GND@2 79.7,13.16 v79.5,12.95 | U2.GND 90.95,18.52 90.42,19.05 89.45,19.05 | U2.GND@4 89.76,3.14 90.93,4.32 90.93,12.95 | 90.93,12.95 90.93,15.17 | 75.15,4.79 79.76,9.4 v79.76,10.16 | 73.66,4.7 U2.GND@3 73.72,4.82 71.15,4.82 70.93,5.05 C28.2 | v89.92,12.7 90.17,12.95 90.93,12.95 | CON1.3 22.86,7.62 v23.11,8.13 | CON4.6 55.28,52.55 v56.25,53.52 | C6.2 47.24,17.51 v46.25,16.52 45.56,15.83 R21.1 | CON4.DET 53.35,39.42 v52.25,40.52 | R30.2 64.38,23.28 Q2.2 66.98,27.69 C23.2 | Q3.2 77.19,51.69 R32.2 77.94,49.04 C31.2 86.69,44.08 88.25,42.52 90.55,42.52 v90.85,42.82 | C16.2 64.95,33.82 v65.25,33.52 | R12.2 59.4,20.28 v59.05,19.92 | R13.2 60.05,29.32 61.35,30.62 v61.35,31.82 | 67.1,35.46 67.25,35.31 | 76.5,31.28 76.5,32.27 v77.55,33.32 | C2.2 19.43,31.55 v18.95,32.02 | U1.9 25.7,26.67 24.53,25.5 C8.2 C4.2 21.06,25.52 v19.25,25.52 | 89.24,31.38 92.11,31.38 v93.25,32.52 | v28.28,52.56 29.22,52.56 30.19,53.52 TP7.TP
  Top 0.254: TP6.TP 93.25,43.52 v93.25,44.52 | TP5.TP 16.25,5.52 v16.25,8.52 | IC2.2 25.7,46.42 C18.2 26.55,44.12 v26.25,43.82 | 13.2,47.42 C20.2 13.35,47.47 IC3.4 15.1,47.47 v16.05,46.52 IC3.2 | C24.2 28.79,51.06 28.25,50.52 28.25,49.58 v28.28,49.56
  Top 0.406: R5.2 74.39,41.48 v73.85,42.02
  Top 0.61: C16.2 67.25,35.31 C19.2 | IC1.6 67.05,50.61 67.05,41.48 IC1.3 67.1,35.46
  Top 1.016: C21.2 13.25,50.71 C20.2
  Bottom 0.203: 43.62,27.62 v43.69,27.69
  Bottom 0.254: v79.76,10.16 79.41,10.5 C25.2 79.41,12.87 v79.5,12.95 | C27.2 C26.2 89.92,11.52 v89.92,12.7 | 9.87,24.85 v9.91,24.89 9.95,24.84 9.95,23.72 10.3,23.37 R9.1 | J1.1 63.24,9.9 v62.48,9.14 | U3.P$41 63.75,50.02 63.25,50.52 | 63.25,50.52 59.25,50.52 v56.25,53.52 | U3.P$43 65.75,50.02 65.25,50.52 63.25,50.52 | C30.2 49.23,41.8 49.45,42.02 U3.P$40 60.35,42.02 v60.65,41.72 | U3.P$37 v60.71,39.02 | 88.42,37.95 U3.P$65 | U3.P$61 90.05,42.02 v90.85,42.82 | U3.P$5 78.75,20.52 v78.95,20.72 74.45,20.72 | U3.P$2 81.75,22.32 v82.25,22.82 | U3.P$1 82.75,20.02 v83.25,20.52 | U3.P$10 73.75,20.02 74.45,20.72 | U3.P$14 69.75,20.02 70.45,20.72 74.45,20.72 | U3.P$78 U3.P$77 90.95,26.02 v91.25,26.32 | U3.P$60 82.75,48.82 84.25,50.32 v84.25,52.52 | v91.25,21.82 90.05,23.02 U3.P$80 | IC4.5 10.87,28.19 v9.51,28.19 | R10.2 17.7,23.37 18.05,23.72 v18.05,23.82 | IC4.2 v14.85,28.22
  Bottom 0.313: U3.P$58 U3.P$57 79.75,49.02 v79.25,49.52 | v79.25,52.52 79.99,52.52 CON5.2 | v84.25,52.52 83.52,52.52 CON5.3
  Bottom 0.406: FB5.2 9.87,24.85 | U3.P$64 90.25,39.02 | 90.25,39.02 91.73,39.02 C29.2 | U3.P$65 89.25,38.02 90.25,39.02 | v10.15,31.42 10.09,31.48 FB4.2
  other vias: 8.41,28.19 14.22,14.22 29.46,30.73 32,30.73 29.46,28.19 32,28.19 34.54,28.19 37.08,28.19 37.08,23.62 34.54,23.62 32,23.62 22.86,5.59 79.25,50.82 79.25,54.52 80.85,54.52 82.65,54.52 84.25,54.52 93.25,29.52 93.25,26.32 93.25,21.52 93.25,18.52 93.25,15.52 93.25,12.52 96.25,12.52 99.25,12.52 102.25,35.52 96.25,35.52 99.25,35.52 102.25,41.52 102.25,38.52 102.25,44.52 102.25,47.52 102.25,50.52 100.25,52.52 102.25,12.52 102.25,6.52 102.25,9.52 98.25,54.52 95.25,54.52 92.25,54.52 89.25,54.52 86.25,54.52 100.25,4.52 98.25,2.52 95.25,2.52 92.25,2.52 16.25,48.22 16.25,44.82
  pour Top: 44.7,24.38 44.7,28.19 47.24,30.73 53.59,30.73 53.59,21.84 47.24,21.84
  pour Top: 28.96,24.64 28.96,31.24 32.78,31.24 32.78,29.21 37.59,29.21 37.59,22.61 30.99,22.61 30.99,24.64
  pour Bottom: 28.96,31.24 28.96,26.16 34.04,26.16 34.8,26.92 34.8,29.21 32.78,29.21 32.78,31.24
  pour Bottom: 30.99,24.64 30.99,22.61 37.59,22.61 37.59,29.21 36.58,29.21 36.58,24.64
  pour Top: 71.63,0 87.12,0 87.12,6.6 92.46,6.6 92.46,17.78 71.63,17.78
  pour Top (isolate 0.254): 0.25,11.68 15.49,11.68 15.49,15.49 10.92,20.07 5.59,20.07 5.08,20.57 5.08,23.37 5.59,23.88 10.41,23.88 11.18,24.64 11.18,33.02 10.67,33.53 0,33.53 0,11.68
  pour Ground: 6.45,56.97 102.45,56.97 arc-90 103.95,55.47 103.95,34.02 94.15,34.02 94.15,14.02 103.95,14.02 103.95,1.47 arc-90 102.45,-0.03 6.45,-0.03 arc-90 4.95,1.47 4.95,3.42 arc90 3.45,4.92 1.5,4.92 arc-90 0,6.42 0,50.47 arc-90 1.5,51.97 3.45,51.97 arc90 4.95,53.47 4.95,55.47 arc-90
  pour Bottom: 0.05,50.42 0.05,35.52 8.25,35.52 8.25,23.22 -0.05,23.22 -0.05,6.42 arc90 1.45,4.92 3.45,4.92 arc-90 4.95,3.42 4.95,1.52 arc90 6.45,0.02 102.45,0.02 arc90 103.95,1.52 103.95,14.02 94.15,14.02 94.15,34.02 103.95,34.02 103.95,55.42 arc90 102.45,56.92 6.45,56.92 arc90 4.95,55.42 4.95,53.42 arc-90 3.45,51.92 1.55,51.92 arc90
  pour V+: 63.85,56.92 63.85,42.92 52.35,42.92 52.35,15.92 55.45,12.82 55.45,0.02 102.45,0.02 arc90 103.95,1.52 103.95,14.02 94.15,14.02 94.15,34.02 103.95,34.02 103.95,55.42 arc90 102.45,56.92
  pour Bottom: 79.25,46.52 84.25,46.52 84.25,50.72 79.25,50.72
  pour Top (no thermals): 15.05,48.72 15.05,44.02 17.45,44.02 17.45,48.82 15.05,48.82
GPS_ANT
  Bottom 0.381: U3.P$79 R38.2
LED1_B
  Top 0.254: U1.59 32.02,34.78 30.48,36.32 11.18,36.32 10.41,37.08 10.41,41.62 8.51,43.52 7.58,43.52 R22.1
LED1_G
  Top 0.254: U1.61 31.02,34.25 29.97,35.31 10.67,35.31 9.4,36.58 9.4,39.12 8.38,40.13 R23.1
LED1_R
  Top 0.254: U1.60 31.52,34.52 30.23,35.81 10.92,35.81 9.91,36.83 9.91,40.4 8.38,41.93 R24.1
LED2_B
  Top 0.254: U1.62 30.52,33.99 29.72,34.8 10.41,34.8 8.89,36.32 8.89,37.59 8.18,38.3 R25.1
LED2_G
  Top 0.254: U1.64 29.52,33.47 29.21,33.78 9.91,33.78 8.89,34.8 R26.1
LED2_R
  Top 0.254: U1.63 30.02,33.73 29.46,34.29 10.16,34.29 8.38,36.07 8.38,36.32 8.13,36.58 R27.1 7.62,36.58
MAIN_ANT
  Bottom 0.381: U3.P$59 CON5.1
MCLR  (via drill 0.6)
  Top 0.254: U1.7 23.1,27.67 22.55,28.22 22.55,30.12 22.25,30.42 R2.1 21.39,31.76 19.88,33.27 13.72,33.27 12.45,32 12.45,19.05 17.78,13.72 CON1.1
  other vias: 17.78,5.59
MEM_SCL
  Top 0.254: R40.1 21.02,18 IC6.1 22.16,12.38 23.88,10.67 36.07,10.67 37.02,11.62 U1.32
MEM_SDA
  Top 0.254: R41.1 24.51,18.45 IC6.3 24.06,11.24 24.13,11.18 35.81,11.18 36.52,11.89 U1.31
N$1
  Top 0.254: C19.1 69.29,37.16
  Top 0.406: C19.1 69.25,38.72 68.8,39.17 IC1.4 | 69.29,37.16 73.89,37.16 74.39,37.66 R4.1
  Top 0.813: IC1.4 68.8,44.07 69.48,44.75 FB1.2
N$2
  pour Bottom: -0.05,34.62 7.45,34.62 7.45,24.02 -0.05,24.02
N$3
  Top 0.254: R1.2 C2.1 R2.2
N$5
  Top 0.254: 70.52,41.45 IC1.5
  Top 0.406: R5.1 R4.2 71.1,38.97 70.52,39.56 70.52,41.45
N$6  (via drill 0.6)
  Top 0.813: v6.37,26.75 7.87,25.24 FB2.2
  Bottom 0.406: CON2.1 5.97,27.15 v6.37,26.75
N$7
  Top 0.254: R6.2 18.45,43.82 17.6,44.67 IC3.1 | 19.71,45.57 FB3.2
  Top 0.61: IC3.1 19.71,45.57
N$8  (via drill 0.4)
  Top 0.254: R23.2 3.85,40.12 2.75,39.02 2.75,17.62 4.85,15.52 6.25,15.52 6.75,15.02 v6.75,12.92
  Bottom 0.254: v6.75,12.92 6.7,12.86 LED1.3
N$9
  Top 0.203: 72.14,19.98 R14.1
  Top 0.254: R14.1 73.91,20.07 75.67,21.83 CON3.C3 | IC5.6 72.64,18.03 72.9,18.29 72.9,18.8 72.64,19.05 72.39,19.05 72.14,19.3 72.14,19.98
N$10  (via drill 0.4)
  Top 0.254: R24.2 4.16,41.93 2.25,40.02 2.25,17.42 4.65,15.02 5.25,15.02 5.75,14.52 v5.75,13.92
  Bottom 0.254: 5.82,13.86 v5.75,13.92 5.85,13.82 5.85,8.92 5.99,8.79 LED1.2
N$11  (via drill 0.4)
  Top 0.254: R22.2 3.88,43.65 1.75,41.52 1.75,17.22 4.75,14.22 v4.75,12.92
  Bottom 0.254: v4.75,12.92 5.25,12.42 5.25,10.52 4.95,10.21 LED1.4
N$12  (via drill 0.4)
  Top 0.254: R26.2 4.52,34.79 4.25,34.52 4.25,18.22 5.45,17.02 11.75,17.02 13.25,15.52 v13.25,12.92
  Bottom 0.254: 13.22,12.89 v13.25,12.92 LED2.3
N$13  (via drill 0.4)
  Top 0.254: R27.2 4.31,36.58 3.75,36.02 3.75,18.02 5.25,16.52 11.25,16.52 12.25,15.52 v12.25,13.92
  Bottom 0.254: LED2.2 12.49,8.79 12.35,8.92 12.35,10.22 12.55,10.42 12.55,12.42 12.25,12.72 v12.25,13.92
N$14  (via drill 0.4)
  Top 0.254: R25.2 4.03,38.3 3.25,37.52 3.25,17.82 5.05,16.02 10.25,16.02 11.25,15.02 v11.25,12.92
  Bottom 0.254: v11.25,12.92 11.95,12.22 11.95,10.62 11.5,10.17 LED2.4
N$15  (via drill 0.6)
  other vias: 30.48,5.59
N$16  (via drill 0.4)
  Top 0.254: R34.2 78.95,32.62 79.55,32.02 81.75,32.02 v82.25,31.52
  Bottom 0.254: U3.P$71 85.75,32.02 85.25,31.52 v82.25,31.52
N$17
  Top 0.254: 62.68,24.69 Q2.1 62.58,24.99 R30.1 R29.2
N$18
  Top 0.254: 57.47,25.03 Q1.1 57.63,23.24 R11.2 R12.1
  Top 0.406: Q1.1 57.63,24.99
N$19
  Top 0.254: R13.1 57.71,28.17 Q1.3
N$20
  Top 0.254: Q3.1 75.49,51.69 R32.1 75.47,49.76 R31.2
N$21  (via drill 0.4)
  Top 0.254: R33.1 72.42,47.96 71.55,48.82 v71.55,50.32
  Bottom 0.254: v71.55,50.32 69.45,50.32 68.16,51.61 LED3.A
N$22  (via drill 0.4)
  Top 0.254: Q3.3 72.22,53.99 v71.65,53.42
  Bottom 0.254: v71.65,53.42 69.68,53.42 LED3.C
N$24
  Top 0.254: R15.1 73.91,21.84 74.34,22.27 74.34,23.54 74.85,24.05 CON3.C7 76.53,24.05 77.22,23.37 77.22,22.35 73.91,19.05 73.91,18.29 73.01,17.38 IC5.5
N$25
  Top 0.254: 72.3,23.54 72.64,23.54 | 72.64,23.54 73.07,23.54 74.85,25.32 CON3.C2 76.53,25.32 77.72,24.13 77.72,22.1 74.42,18.8 74.42,18.03 73.12,16.73 IC5.4 | R16.1 72.57,23.62 72.64,23.54
N$26
  Bottom 0.254: 93.65,24.02 R39.1
  Bottom 0.381: R38.1 93.65,24.02 ANT1.FEED
N$27  (via drill 0.4)
  Top 0.254: v82.15,33.92 80.5,33.92 R35.2
  Bottom 0.254: U3.P$68 87.05,35.02 86.65,34.62 86.65,33.12 86.25,32.72 82.65,32.72 82.15,33.22 v82.15,33.92
N$28
  Bottom 0.254: U3.P$67 89.9,36.02 R36.2
N$29
  Bottom 0.254: U3.P$66 90.3,37.02 R37.2
N$30
  Bottom 0.406: CON2.S6 1.45,30.91 CON2.S4 CON2.S3 CON2.S2 CON2.S1 1.45,25.99 CON2.S5 5.19,25.99 5.55,25.62 5.55,25.22 5.92,24.85 FB5.1
N$31
  Bottom 0.406: CON2.5 5.08,29.75 5.45,30.12 5.45,31.22 5.71,31.48 FB4.1
N$32
  Bottom 0.254: CON2.2 6.78,27.8 7.3,27.27 IC4.4 12.1,27.27 13.15,26.22 R7.2 R9.2
N$33
  Bottom 0.254: CON2.3 6.38,28.45 7.1,29.17 IC4.6 11.9,29.17 12.95,30.22 15.05,30.22 15.85,29.42 15.85,27.22 14.85,26.22 R8.2 R10.1
NET_STATUS  (via drill 0.4)
  Top 0.254: R31.1 73.73,52.75 v73.65,52.82 | v42.25,41.52 41.05,40.32 41.05,31.62 40.1,30.67 U1.48
  Bottom 0.254: v73.65,52.82 73.65,50.12 73.75,50.02 U3.P$51 73.75,46.42 73.45,46.12 45.95,46.12 44.55,47.52 42.25,47.52 41.25,46.52 41.25,42.52 v42.25,41.52
OSC1
  Top 0.203: U1.39 45.91,26.17 Y1.P$2 49.74,24.62 C14.1
  Top 0.254: R3.1 50.52,24.02 C14.1
OSC2
  Top 0.203: U1.40 45.83,26.67 Y1.P$1 47.59,28.19 49.78,28.19 50.43,28.84 C15.1
  Top 0.254: R3.2 50.52,28.92 C15.1
PGEC1  (via drill 0.4, 0.6)
  Top 0.254: CON1.5 27.94,4.06 27.43,3.56 24.64,3.56 24.13,4.06 24.13,7.7 v24.66,8.23 | v24.89,22.1 24.89,22.86 25.71,23.67 U1.15
  Bottom 0.254: v24.66,8.23 24.66,21.87 v24.89,22.1
  other vias: 27.94,5.59
PGED1  (via drill 0.4, 0.6)
  Top 0.254: CON1.4 25.4,7.62 25.65,7.87 27.69,7.87 27.76,7.95 v27.76,8.23 | v26.16,22.1 26.16,22.86 26.48,23.17 U1.16
  Bottom 0.254: v27.76,8.23 27.76,20.5 v26.16,22.1
  other vias: 25.4,5.59
POWER_ON  (via drill 0.4)
  Top 0.254: Q2.3 63.53,27.93 65.13,29.52 v66.25,29.52
  Bottom 0.254: U3.P$3 80.75,27.02 78.25,29.52 v66.25,29.52
SCK1  (via drill 0.4)
  Top 0.254: CON4.5 54.18,49.25 53.65,48.72 47.45,48.72 44.45,45.72 v42.55,45.72 | v42.55,43.72 42.55,42.92 39.25,39.62 39.25,36.42 37.02,34.19 U1.49
  Bottom 0.254: v42.55,45.72 v42.55,43.72
SD_CS
  Top 0.254: U1.52 35.52,34.79 37.65,36.92 37.65,39.62 36.35,40.92 34.65,40.92 34.2,41.38 R18.1 35.19,42.26 35.65,42.72 35.65,51.92 37.25,53.52 49.95,53.52 50.88,52.59 CON4.2
SD_DETECT
  Top 0.254: CON4.SW 57.75,48.42 56.85,47.52 47.85,47.52 43.82,43.49 R17.1 43.82,32.09 41.9,30.17 U1.47
SDI1
  Top 0.254: CON4.7 56.38,48.65 55.85,48.12 47.65,48.12 44.15,44.62 42.25,44.62 41.35,43.72 41.35,42.72 40.85,42.22 R20.1 39.8,40.97 38.65,39.82 38.65,36.52 36.52,34.39 U1.50
SDO1
  Top 0.254: U1.51 36.02,34.59 38.15,36.72 38.15,39.82 37,40.98 R19.1 38.05,42.22 38.45,42.62 38.45,47.52 39.25,48.32 46.25,48.32 47.15,49.22 51.35,49.22 51.98,49.85 CON4.3
SIM_RESET  (via drill 0.4)
  Top 0.254: v66.25,15.52 66.25,20.52 69.35,23.62 R16.2
  Bottom 0.254: U3.P$18 65.75,16.02 v66.25,15.52
USIM_CLK  (via drill 0.4)
  Top 0.254: v65.05,14.72 67.15,14.72 67.65,15.22 67.65,18.92 68.8,20.07 R14.2
  Bottom 0.254: U3.P$19 64.75,15.02 v65.05,14.72
USIM_DATA  (via drill 0.4)
  Top 0.254: v68.35,21.22 68.97,21.84 R15.2
  Bottom 0.254: U3.P$17 66.75,19.62 v68.35,21.22
V_USIM  (via drill 0.4)
  Top 0.254: C22.1 C23.1 73.15,27.69 73.33,27.86 CON3.C1 76.53,27.86 78.23,26.16 78.23,21.84 74.93,18.54 74.93,17.78 73.15,16 71.63,16 71.12,16.51 71.12,17.78 70.87,18.03 IC5.1 69.06,18.03 68.25,17.22 68.25,14.52 67.25,13.52 v64.25,13.52
  Bottom 0.254: U3.P$20 63.75,14.02 v64.25,13.52
VBUS  (via drill 0.4)
  Top 0.254: 6.6,21.84 7.02,22.26 FB2.1 v7.87,21.08 v9.65,21.34 v9.65,22.35 | 6.6,21.84 v6.1,21.34 | v6.1,22.35 6.6,21.84 | C20.1 13.35,45.57 IC3.5 | C20.1 13.25,44.52 14.05,43.72 R6.1 | C20.1 13.2,45.62
  Top 1.016: 13.2,45.62 v11.15,45.62
  other vias: 8.65,46.92 9.95,46.92 11.15,46.92 8.65,45.62 9.95,45.62
  pour Top: 5.59,20.83 10.41,20.83 10.41,23.11 5.59,23.11
  pour V+: 14.99,11.7 0,11.74 0,50.47 arc-90 1.5,51.97 3.45,51.97 arc90 4.95,53.47 4.95,55.47 arc-90 6.45,56.97 14.22,56.97 14.22,44.45 11.94,42.16 11.94,27.94 14.99,24.89
  pour Top (no thermals): 7.95,45.22 7.95,47.62 11.65,47.62 11.75,47.62 11.75,46.32 12.65,46.32 12.65,44.82 7.95,44.82
VCAP
  Top 0.254: C3.1 34.95,39.62 35.55,40.22 36.21,40.22 37.08,39.35 37.08,37.08 35.81,35.81 34.54,35.81 33.52,34.79 U1.56 33.52,31.35 33.95,30.92 37.25,30.92 TP1.TP

### Text on the board
tNames: ClickMeter_V1.9.3 | C30
225bmp: ClickMeter v1.9.4 | Minimum drill = 0.4 (vias) | Units: mm